# EAGLE design BEP33_2panel_v2_90Gradtvm802 (EAGLE 7.7.0)
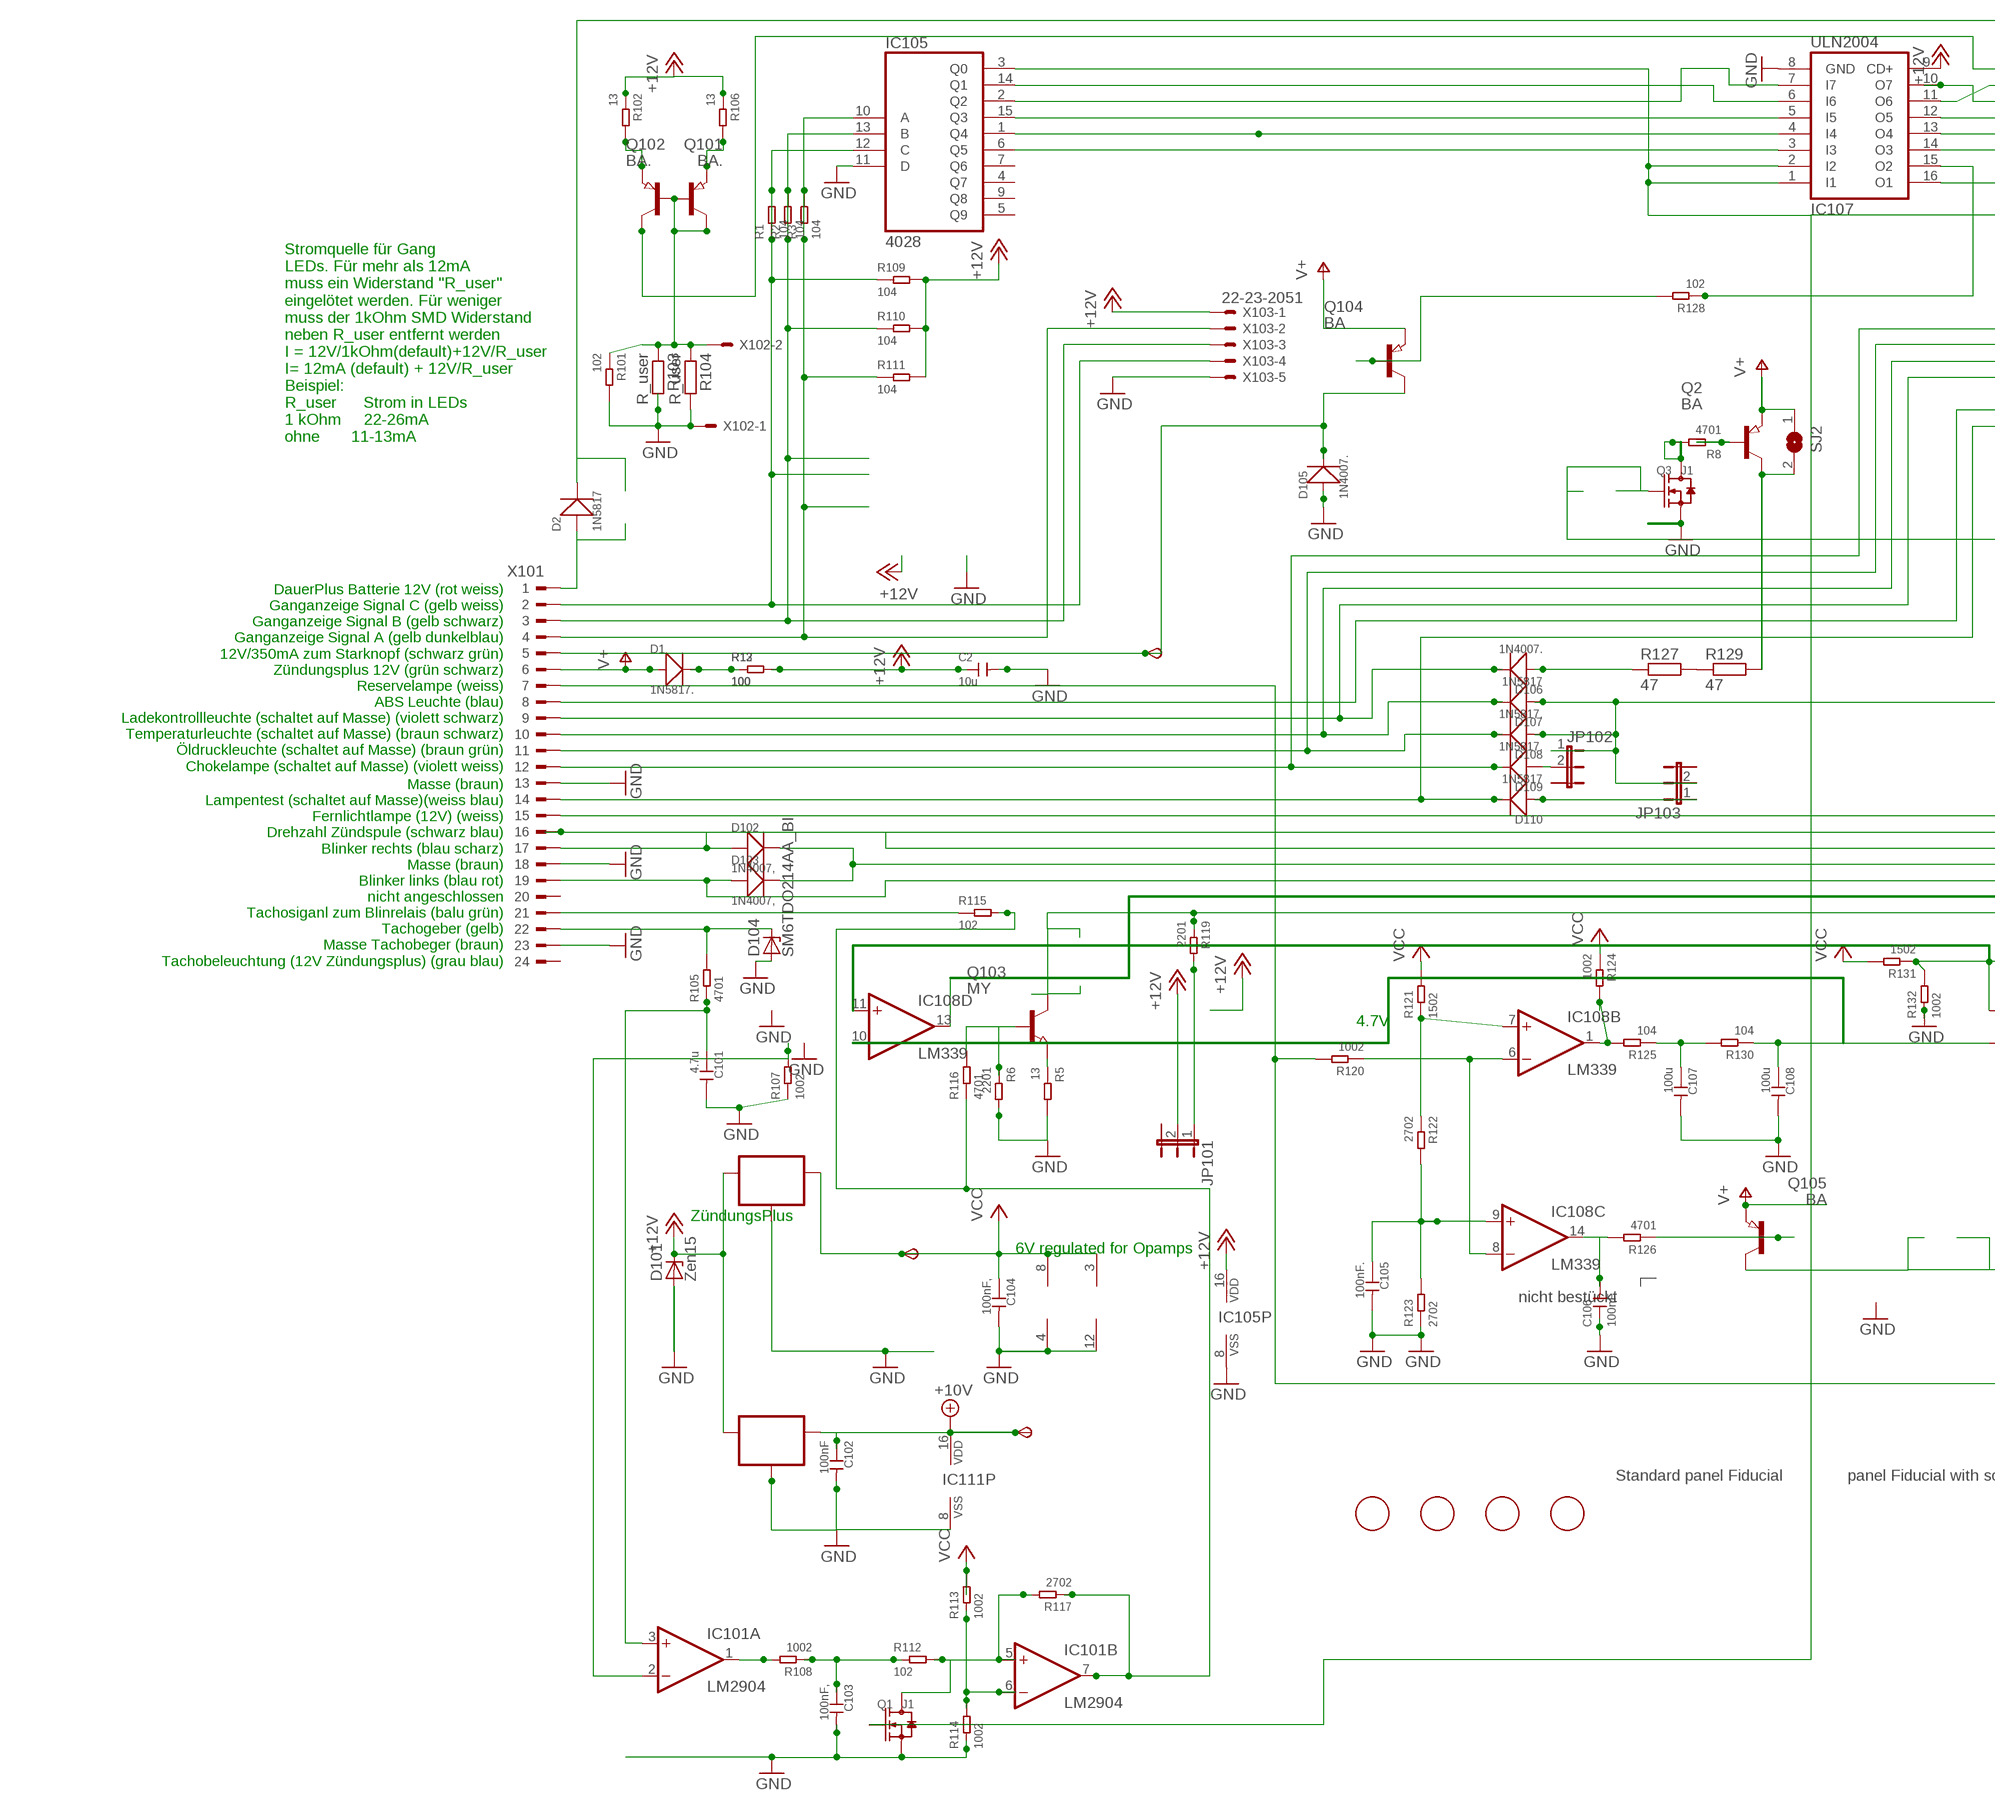
[diagram p0: schematic, sheet 1, part 1 of 2]
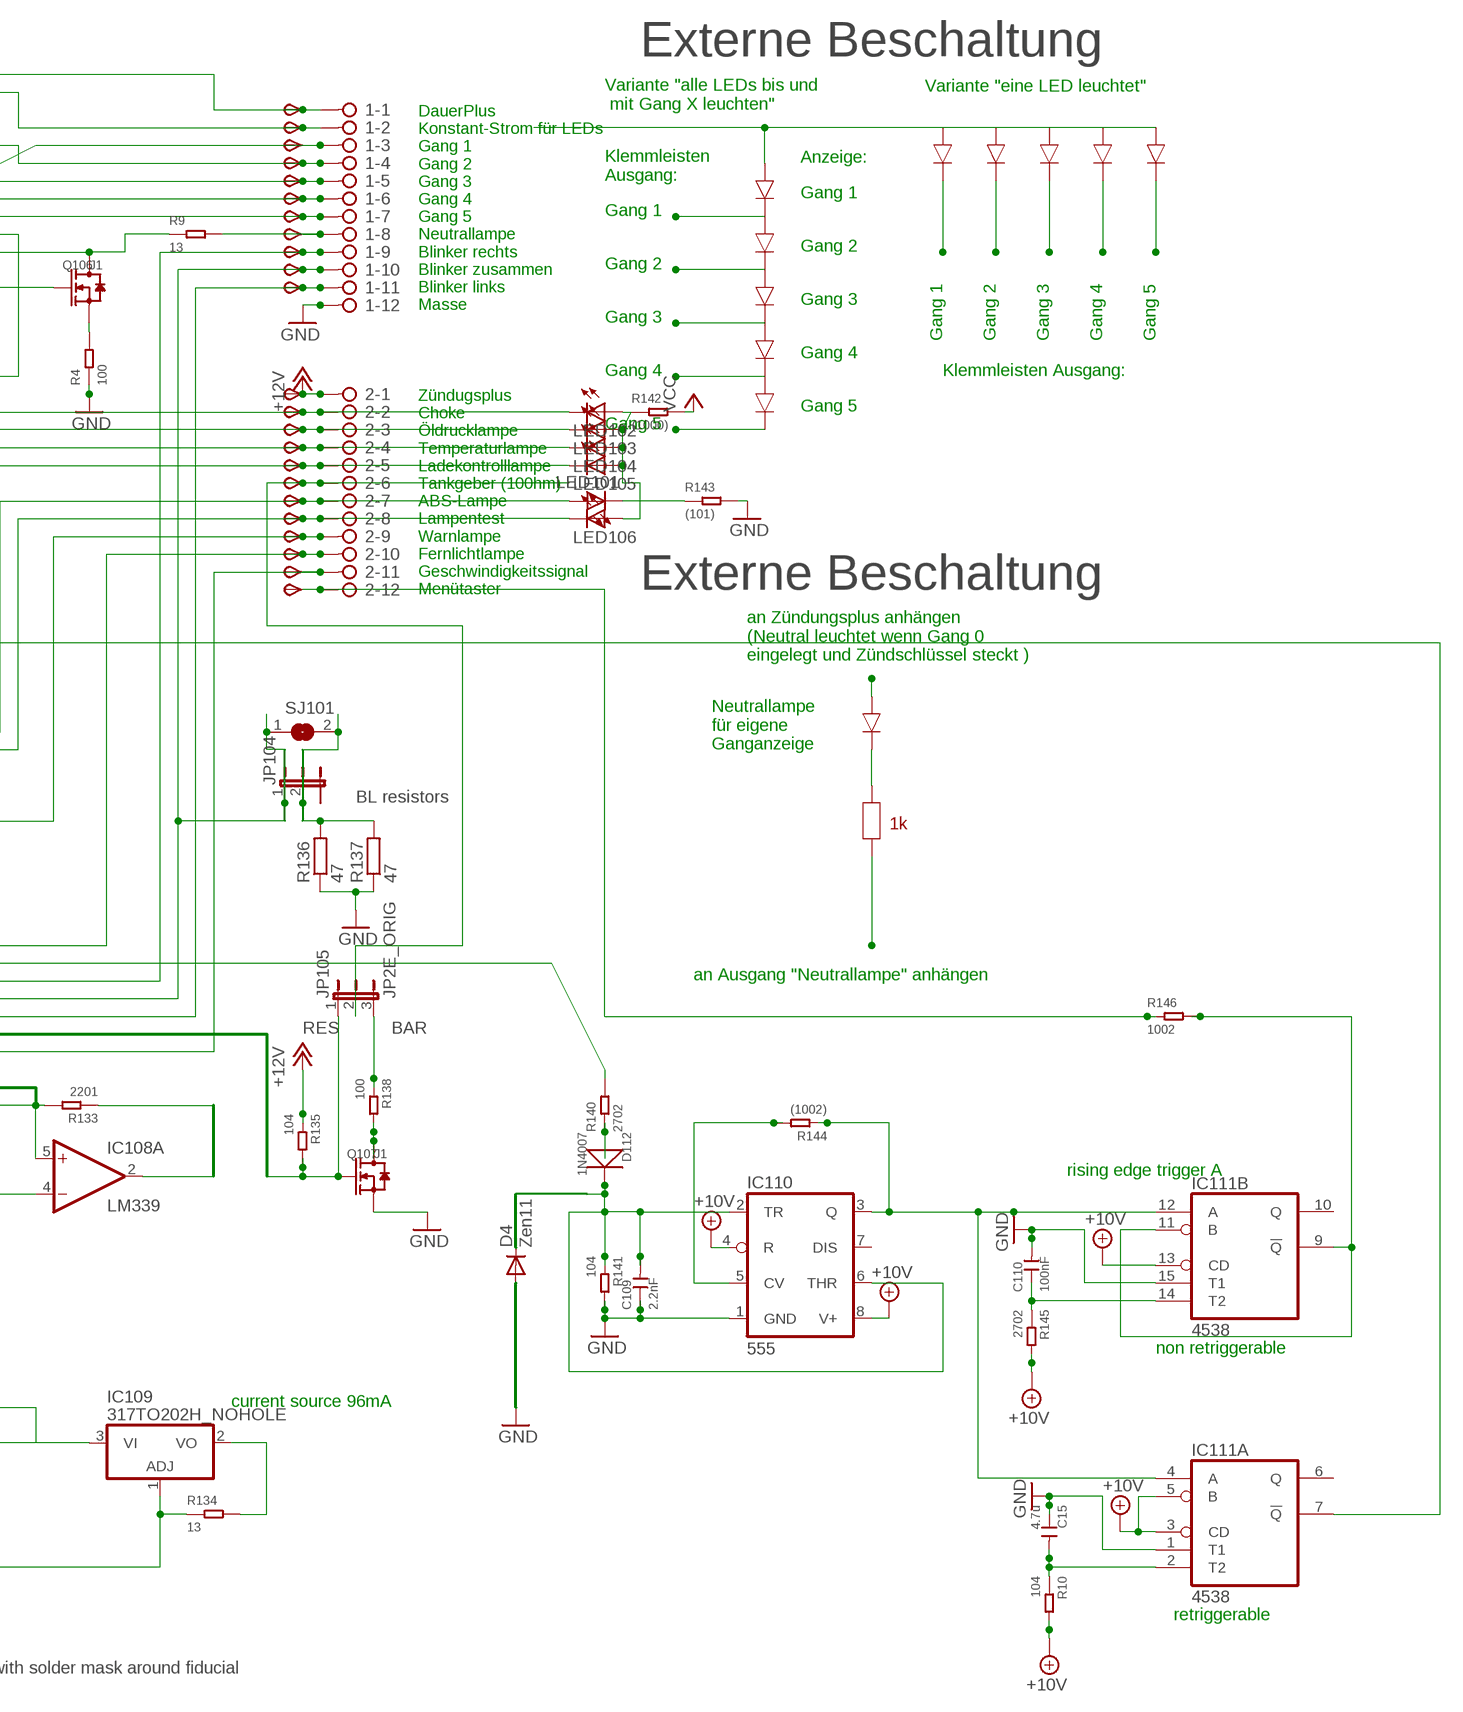
[diagram p1: schematic, sheet 1, part 2 of 2]

## Parts
1  2081-1132  [12-PIN]
2  2081-1132  [12-PIN]
6V  TPSB2.0  [B2.0]
10V  TPSB2.0  [B2.0]
C2  10u  CERAMIC-100UF-6.3V-20%-X5R(1206)  [C1206]
C15  4.7u  CERAMIC-4.7UF-25V-10%-X5R(0805)  [C0805]
C101  4.7u  CERAMIC-4.7UF-25V-10%-X5R(0805)  [C0805]
C102  100nF  CERAMIC-100NF-50V-10%-X7R(0805)  [C0805]
C103  100nF,  CERAMIC-100NF-50V-10%-X7R(0805)  [C0805]
C104  100nF,  CERAMIC-100NF-50V-10%-X7R(0805)  [C0805]
C105  100nF.  CERAMIC-100NF-50V-10%-X7R(0805)  [C0805]
C106  100nF.  CERAMIC-100NF-50V-10%-X7R(0805)  [C0805]
C107  100u  CERAMIC-100UF-6.3V-20%-X5R(1206)  [C1206]
C108  100u  CERAMIC-100UF-6.3V-20%-X5R(1206)  [C1206]
C109  2.2nF  CERAMIC-100NF-50V-10%-X7R(0805)  [C0805]
C110  100nF  CERAMIC-100NF-50V-10%-X7R(0805)  [C0805]
D1  1N5817.  DIODE-GEN-PURPOSE-1KV-1A(DO-214AC)DO-214AC/1206  [DO-214AC_SLIM]
D2  1N5817  DIODE-GEN-PURPOSE-1KV-1A(DO-214AC)DO-214AC/1206  [DO-214AC_SLIM]
D4  Zen11  CGRM4001-G  [SOD-123_MINI-SMA]
D101  Zen15  SM6T  [DO214AA]
D102  1N4007,  DIODE-GEN-PURPOSE-1KV-1A(DO-214AC)  [DO-214AC]
D103  1N4007,  DIODE-GEN-PURPOSE-1KV-1A(DO-214AC)  [DO-214AC]
D104  SM6TDO214AA_BI  [DO214AA_BI]
D105  1N4007.  DIODE-GEN-PURPOSE-1KV-1A(DO-214AC)  [DO-214AC]
D106  1N4007.  DIODE-GEN-PURPOSE-1KV-1A(DO-214AC)  [DO-214AC]
D107  1N5817  DIODE-GEN-PURPOSE-1KV-1A(DO-214AC)DO-214AC/1206  [DO-214AC_SLIM]
D108  1N5817.  DIODE-GEN-PURPOSE-1KV-1A(DO-214AC)DO-214AC/1206  [DO-214AC_SLIM]
D109  1N5817.  DIODE-GEN-PURPOSE-1KV-1A(DO-214AC)DO-214AC/1206  [DO-214AC_SLIM]
D110  1N5817  DIODE-GEN-PURPOSE-1KV-1A(DO-214AC)DO-214AC/1206  [DO-214AC_SLIM]
D112  1N4007  DIODE-GEN-PURPOSE-1KV-1A(DO-214AC)  [DO-214AC]
FID1  FIDUCIAL  [FIDUCIAL_1MM]
FID2  FIDUCIAL  [FIDUCIAL_1MM]
FID102  FIDUCIAL  [FIDUCIAL_1MM]
FID104  FIDUCIAL  [FIDUCIAL_1MM]
IC101  LM2904  LM358D  [SO08]
IC102  78L06  78LXXSOT89_ROUND  [SOT89_ROUND]
IC104  78L10  78LXXSOT89_ROUND  [SOT89_ROUND]
IC105  4028  4028D  [SO16]
IC107  ULN2004  ULN2004AD  [SO16]
IC108  LM339  LM339D  [SO14]
IC109  317TO202H_NOHOLE  [TO220H_NOHOLE]
IC110  555  NE555D  [SO08]
IC111  4538  4538D  [SO16]
JP101  JP2EJP2_SMALLPADS  [JP2_SMALLPADS]
JP102  JP2EJP2_SMALLPADS  [JP2_SMALLPADS]
JP103  JP2EJP2_SMALLPADS  [JP2_SMALLPADS]
JP104  JP2EJP2_SMALLPADS  [JP2_SMALLPADS]
JP105  JP2E_ORIG  [JP2_ORIG_SMALLPADS]
LED101  LEDLD260  [LD260]
LED102  LEDLD260  [LD260]
LED103  LEDLD260  [LD260]
LED104  LEDLD260  [LD260]
LED105  LEDLD260  [LD260]
LED106  LEDLD260  [LD260]
Q1  J1  SMD-MOSFET-N-CH-50V-200MA-BSS138W-7-F(SOT-23)  [SOT-23]
Q2  BA  PNP-TRANSISTOR_SOT89  [SOT89]
Q3  J1  SMD-MOSFET-N-CH-50V-200MA-BSS138W-7-F(SOT-23)  [SOT-23]
Q101  BA.  PNP-TRANSISTOR_SOT89  [SOT89]
Q102  BA.  PNP-TRANSISTOR_SOT89  [SOT89]
Q103  MY  NPN-TRANSISTOR_SOT89  [SOT89]
Q104  BA  PNP-TRANSISTOR_SOT89  [SOT89]
Q105  BA  PNP-TRANSISTOR_SOT89  [SOT89]
Q106  J1  SMD-MOSFET-N-CH-50V-200MA-BSS138W-7-F(SOT-23)  [SOT-23]
Q107  J1  SMD-MOSFET-N-CH-50V-200MA-BSS138W-7-F(SOT-23)  [SOT-23]
R1  104  SMD-RES-10K-1%-1/8W(0805)  [R0805]
R2  104  SMD-RES-10K-1%-1/8W(0805)  [R0805]
R3  104  SMD-RES-10K-1%-1/8W(0805)  [R0805]
R4  100  SMD-RES-220R-5%-1/8W(0805)  [R0805]
R5  13  SMD-RES-13R-5%-1/4W(1206)  [R1206]
R6  2201  SMD-RES-1K-5%-1/8W(0805)  [R0805]
R8  4701  SMD-RES-4.7K-5%-1/8W(0805)  [R0805]
R9  13  SMD-RES-13R-5%-1/4W(1206)  [R1206]
R10  104  SMD-RES-4.7K-5%-1/8W(0805)  [R0805]
R12  100  SMD-RES-2.2K-5%-1/8W(0805)  [R0805]
R13  100  SMD-RES-2.2K-5%-1/8W(0805)  [R0805]
R101  102  SMD-RES-1K-5%-1/8W(0805)  [R0805]
R102  13  SMD-RES-13R-5%-1/4W(1206)  [R1206]
R103  R_user  R-EU_R0805  [R0805]
R104  R_user  R-EU_R0805  [R0805]
R105  4701  SMD-RES-4.7K-5%-1/8W(0805)  [R0805]
R106  13  SMD-RES-13R-5%-1/4W(1206)  [R1206]
R107  1002  SMD-RES-10K-1%-1/8W(0805)  [R0805]
R108  1002  SMD-RES-10K-1%-1/8W(0805)  [R0805]
R109  104  SMD-RES-10K-1%-1/8W(0805)  [R0805]
R110  104  SMD-RES-10K-1%-1/8W(0805)  [R0805]
R111  104  SMD-RES-10K-1%-1/8W(0805)  [R0805]
R112  102  SMD-RES-1K-5%-1/8W(0805)  [R0805]
R113  1002  SMD-RES-1K-5%-1/8W(0805)  [R0805]
R114  1002  SMD-RES-1K-5%-1/8W(0805)  [R0805]
R115  102  SMD-RES-220R-5%-1/8W(0805)  [R0805]
R116  4701  SMD-RES-4.7K-5%-1/8W(0805)  [R0805]
R117  2702  SMD-RES-4.7K-5%-1/8W(0805)  [R0805]
R119  2201  SMD-RES-2.2K-5%-1/8W(0805)  [R0805]
R120  1002  SMD-RES-10K-1%-1/8W(0805)  [R0805]
R121  1502  SMD-RES-10K-1%-1/8W(0805)  [R0805]
R122  2702  SMD-RES-4.7K-5%-1/8W(0805)  [R0805]
R123  2702  SMD-RES-4.7K-5%-1/8W(0805)  [R0805]
R124  1002  SMD-RES-10K-1%-1/8W(0805)  [R0805]
R125  104  SMD-RES-10K-1%-1/8W(0805)  [R0805]
R126  4701  SMD-RES-4.7K-5%-1/8W(0805)  [R0805]
R127  47  R-EU_V235/17_1MM  [V235/17_1MM]
R128  102  SMD-RES-1K-5%-1/8W(0805)  [R0805]
R129  47  R-EU_V235/17_1MM  [V235/17_1MM]
R130  104  SMD-RES-10K-1%-1/8W(0805)  [R0805]
R131  1502  SMD-RES-10K-1%-1/8W(0805)  [R0805]
R132  1002  SMD-RES-10K-1%-1/8W(0805)  [R0805]
R133  2201  SMD-RES-2.2K-5%-1/8W(0805)  [R0805]
R134  13  SMD-RES-13R-5%-1/4W(1206)  [R1206]
R135  104  SMD-RES-10K-1%-1/8W(0805)  [R0805]
R136  47  R-EU_V235/17_1MM  [V235/17_1MM]
R137  47  R-EU_V235/17_1MM  [V235/17_1MM]
R138  100  SMD-RES-2.2K-5%-1/8W(0805)  [R0805]
R140  2702  SMD-RES-10K-1%-1/8W(0805)  [R0805]
R141  104  SMD-RES-10K-1%-1/8W(0805)  [R0805]
R142  (1000)  SMD-RES-100R-5%-1/8W(0805)  [R0805]
R143  (101)  SMD-RES-100R-5%-1/8W(0805)  [R0805]
R144  (1002)  SMD-RES-10K-1%-1/8W(0805)  [R0805]
R145  2702  SMD-RES-4.7K-5%-1/8W(0805)  [R0805]
R146  1002  SMD-RES-4.7K-5%-1/8W(0805)  [R0805]
SJ2  SJ  [SJ]
SJ101  SJ  [SJ]
START  TPSB2.0  [B2.0]
TP1  TPSB2.0  [B2.0]
TP2  TPSB2.0  [B2.0]
TP3  TPSB2.0  [B2.0]
TP4  TPSB2.0  [B2.0]
TP5  TPSB2.0  [B2.0]
TP6  TPSB2.0  [B2.0]
TP7  TPSB2.0  [B2.0]
TP8  TPSB2.0  [B2.0]
TP9  TPSB2.0  [B2.0]
TP10  TPSB2.0  [B2.0]
TP11  TPSB2.0  [B2.0]
TP12  TPSB2.0  [B2.0]
TP13  TPSB2.0  [B2.0]
TP16  TPSB2.0  [B2.0]
TP17  TPSB2.0  [B2.0]
TP18  TPSB2.0  [B2.0]
TP19  TPSB2.0  [B2.0]
TP21  TPSB2.0  [B2.0]
TP22  TPSB2.0  [B2.0]
TP23  TPSB2.0  [B2.0]
TP24  TPSB1,27  [B1,27]
TP25  TPSB2.0  [B2.0]
TP26  TPSB2.0  [B2.0]
X101  CON_BMWV2  [24-PIN_V2]
X102  22-23-2021  [22-23-2021]
X103  22-23-2051  [22-23-2051]

## Nets
+10V: 10V.TP(PP) C102.1 IC104.1(OUT) IC110.4(R) IC110.8(V+) IC111.3(A:CD) IC111.5(A:B) IC111.13(B:CD) IC111.16(P:VDD) R10.2 R145.2
+12V: 2.1 C2.1 D101.C IC102.3(IN) IC104.3(IN) IC105.16(VDD) IC107.9(CD+) JP101.2 R12.2 R13.2 R102.1 R106.1 R109.2 R110.2 R111.2 R135.1 TP12.TP(PP) X103.1
+12V1: 2.11 Q103.2(C) R119.1 TP26.TP(PP)
GND: 1.12 C2.2 C15.1 C101.2 C102.2 C103.2 C104.2 C105.2 C106.1 C107.2 C108.2 C109.1 C110.2 D4.A D101.A D104.A D105.1(+) IC101.4(P:V-) IC102.2(GND) IC102.2@1(GND) IC104.2(GND) IC104.2@1(GND) IC105.8(VSS) IC105.11(D) IC107.8(GND) IC108.12(P:GND) IC110.1(GND) IC111.1(A:T1) IC111.8(P:VSS) IC111.15(B:T1) Q1.2(S) Q3.2(S) Q107.2(S) R4.1 R5.2 R6.2 R101.2 R103.2 R104.2 R107.1 R114.1 R123.1 R132.1 R136.1 R137.1 R141.2 R143.2 X101.13 X101.18 X101.23 X102.1 X103.5
N$1: 2.9 D107.1(+) D108.1(+) JP102.1 JP103.2 TP24.TP(PP)
N$2: IC105.10(A) R3.1 R3.2 R111.1 X101.4 X103.2
N$3: IC105.13(B) R2.1 R2.2 R110.1 X101.3 X103.3
N$4: 2.7 LED101.A TP22.TP(PP) X101.8
N$5: Q101.3(E) R102.2
N$6: Q2.1(B) R8.1
N$7: IC101.2(A:-IN) R107.2
N$8: R127.2 R129.1
N$9: Q102.3(E) R106.2
N$11: D105.2(-) Q104.2(C) START.TP(PP) X101.5
N$12: 2.2 D109.2(-) LED102.K(C) TP16.TP(PP) X101.12
N$13: 2.3 D108.2(-) LED103.K(C) TP17.TP(PP) X101.11
N$14: 2.4 D107.2(-) LED104.K(C) TP18.TP(PP) X101.10
N$15: IC109.3(VI) Q105.2(C)
N$16: IC108.6(B:-IN) IC108.8(C:-IN) R120.1
N$17: IC105.12(C) R1.1 R1.2 R109.1 X101.2 X103.4
N$18: IC105.15(Q3) IC107.5(I5)
N$19: 2.8 D110.2(-) LED106.K(C) TP23.TP(PP) X101.14
N$20: 1.9 D102.1(+) TP9.TP(PP) X101.17
N$21: 1.11 D103.1(+) TP11.TP(PP) X101.19
N$22: IC111.9(B:!Q) IC111.11(B:B) R146.2
N$23: D104.C R105.2 X101.22
N$24: C101.1 IC101.3(A:+IN) R105.1
N$25: 1.6 IC107.13(O4) TP6.TP(PP)
N$26: 1.7 IC107.14(O3) TP7.TP(PP)
N$27: D1.2(-) R12.1 R13.1
N$28: 2.6 JP105.2 TP21.TP(PP)
N$29: JP101.1 R119.2
N$30: C105.1 IC108.9(C:+IN) R122.2 R123.2
N$31: C106.2 IC108.14(C:OUT) R126.2
N$32: Q3.3(D) R8.2
N$34: LED101.K(C) R143.1
N$35: IC109.1(ADJ) R120.2 R134.1 X101.7
N$36: Q105.1(B) R126.1
N$37: IC105.2(Q2) IC107.7(I7)
N$38: 1.3 IC107.11(O6) TP3.TP(PP)
N$39: 1.5 IC107.12(O5) TP5.TP(PP)
N$41: LED102.A LED103.A LED104.A LED105.A LED106.A R142.1
N$42: R140.2 X101.16
N$43: Q104.1(B) R128.2
N$44: IC105.3(Q0) IC107.1(I1) IC107.2(I2) Q1.1(G) Q106.1(G)
N$45: C107.1 R125.1 R130.2
N$46: C108.1 IC108.4(A:-IN) IC108.10(D:-IN) R130.1
N$47: IC108.5(A:+IN) IC108.11(D:+IN) R131.1 R132.2 R133.2
N$48: Q107.3(D) R138.2
N$49: IC111.7(A:!Q) Q3.1(G)
N$50: IC105.1(Q4) IC107.4(I4)
N$51: R115.1 X101.21
N$52: IC107.16(O1) Q106.3(D) R9.1
N$53: 2.10 TP25.TP(PP) X101.15
N$54: D106.1(+) R127.1
N$55: 2.5 D106.2(-) LED105.K(C) TP19.TP(PP) X101.9
N$56: IC105.14(Q1) IC107.6(I6)
N$57: Q101.1(B) Q102.1(B) Q102.2(C) R101.1 R103.1 R104.1 X102.2
N$58: 1.8 R9.2 TP8.TP(PP)
N$59: 1.2 Q101.2(C) TP2.TP(PP)
N$60: IC108.13(D:OUT) JP105.1 Q107.1(G) R135.2
N$61: IC105.6(Q5) IC107.3(I3)
N$64: IC109.2(VO) R134.2
N$65: IC110.5(CV) R144.2
N$67: 1.4 IC107.10(O7) TP4.TP(PP)
N$69: 1.1 D2.2(-) TP1.TP(PP)
N$83: IC108.7(B:+IN) R121.1 R122.1
N$84: Q106.2(S) R4.2
N$85: Q103.1(B) R6.1 R116.2
N$86: IC110.3(Q) IC111.4(A:A) IC111.12(B:A) R144.1
N$87: D112.1(+) R140.1
N$88: IC107.15(O2) R128.1
N$89: C110.1 IC111.14(B:T2) R145.1
N$90: 2.12 R146.1 TP13.TP(PP)
N$91: D2.1(+) X101.1
N$92: IC101.1(A:OUT) R108.2
N$93: 1.10 D102.2(-) D103.2(-) JP104.1 SJ101.1 TP10.TP(PP)
N$94: JP104.2 R136.2 R137.2 SJ101.2
N$95: D109.1(+) JP102.2
N$96: C103.1 R108.1 R112.1
N$97: IC101.5(B:+IN) Q1.3(D) R112.2 R117.2
N$98: D110.1(+) JP103.1
N$99: JP105.3 R138.1
N$100: Q103.3(E) R5.1
N$101: IC101.6(B:-IN) R113.1 R114.2
N$102: C109.2 D4.C D112.2(-) IC110.2(TR) IC110.6(THR) R141.1
N$103: C15.2 IC111.2(A:T2) R10.1
N$104: Q2.2(C) R129.2 SJ2.2
N$107: IC101.7(B:OUT) R115.2 R116.1 R117.1
N$108: IC108.2(A:OUT) R133.1
N$580: IC108.1(B:OUT) R124.2 R125.2
V+: D1.1(+) Q2.3(E) Q104.3(E) Q105.3(E) SJ2.1 X101.6
VCC: 6V.TP(PP) C104.1 IC101.8(P:V+) IC102.1(OUT) IC108.3(P:V+) R113.2 R121.2 R124.1 R131.2 R142.2
Unconnected: IC105.4(Q7) IC105.5(Q9) IC105.7(Q6) IC105.9(Q8) IC110.7(DIS) IC111.6(A:Q) IC111.10(B:Q) X101.20 X101.24

## Notes on the sheet
- Externe Beschaltung
- Variante "eine LED leuchtet"
- Variante "alle LEDs bis und
   mit Gang X leuchten"
- Anzeige:
- Klemmleisten
  Ausgang:
- Gang 1
- DauerPlus
  Konstant-Strom für LEDs
  Gang 1
  Gang 2
  Gang 3
  Gang 4
  Gang 5
  Neutrallampe
  Blinker rechts
  Blinker zusammen
  Blinker links
  Masse
- Gang 1
- Gang 2
- Gang 2
- Gang 3
- Gang 3
- Gang 1 | Gang 2 | Gang 3 | Gang 4 | Gang 5
- Gang 4
- Gang 4 | Klemmleisten Ausgang:
- Gang 5
- Gang 5
- Zündugsplus
  Choke
  Öldrucklampe
  Temperaturlampe
  Ladekontrolllampe
  Tankgeber (100hm)
  ABS-Lampe
  Lampentest
  Warnlampe
  Fernlichtlampe
  Geschwindigkeitssignal
  Menütaster
- Stromquelle für Gang
  LEDs. Für mehr als 12mA
  muss ein Widerstand "R_user"
  eingelötet werden. Für weniger
  muss der 1kOhm SMD Widerstand
  neben R_user entfernt werden
  I = 12V/1kOhm(default)+12V/R_user
  I= 12mA (default) + 12V/R_user
  Beispiel:
  R_user      Strom in LEDs
  1 kOhm     22-26mA
  ohne       11-13mA
- Externe Beschaltung
- an Zündungsplus anhängen
  (Neutral leuchtet wenn Gang 0
  eingelegt und Zündschlüssel steckt )
- Neutrallampe
  für eigene
  Ganganzeige
- DauerPlus Batterie 12V (rot weiss)
  Ganganzeige Signal C (gelb weiss)
  Ganganzeige Signal B (gelb schwarz)
  Ganganzeige Signal A (gelb dunkelblau)
  12V/350mA zum Starknopf (schwarz grün)
  Zündungsplus 12V (grün schwarz)
  Reservelampe (weiss)
  ABS Leuchte (blau)
  Ladekontrollleuchte (schaltet auf Masse) (violett schwarz)
  Temperaturleuchte (schaltet auf Masse) (braun schwarz)
  Öldruckleuchte (schaltet auf Masse) (braun grün)
  Chokelampe (schaltet auf Masse) (violett weiss)
- BL resistors
- 1k
- an Ausgang "Neutrallampe" anhängen
- Masse (braun)
  Lampentest (schaltet auf Masse)(weiss blau)
  Fernlichtlampe (12V) (weiss)
  Drehzahl Zündspule (schwarz blau)
  Blinker rechts (blau scharz)
  Masse (braun)
  Blinker links (blau rot)
  nicht angeschlossen
  Tachosiganl zum Blinrelais (balu grün)
  Tachogeber (gelb)
  Masse Tachobeger (braun)
  Tachobeleuchtung (12V Zündungsplus) (grau blau)
- RES | BAR
- 4.7V | rising edge trigger A
- non retriggerable
- ZündungsPlus
- current source 96mA
- 6V regulated for Opamps
- nicht bestückt
- retriggerable
- Standard panel Fiducial | panel Fiducial with solder mask around fiducial

## Library data of the parts
1 2 = con WAGO BMW:2081-1132: WAGO SREW CLAMP
6V 10V START TP1-TP13 TP16-TP19 TP21-TP26 = testpin_BMW:TPS: TEST PIN
C2 C107 C108 = Seeed-Capacitor-2016:CERAMIC-100UF-6.3V-20%-X5R(1206): 302010183; MPN: GRM31CR60J107ME39L; VALUE: 100uf
C15 C101 = Seeed-Capacitor-2016:CERAMIC-4.7UF-25V-10%-X5R(0805): 302010146; MPN: CC0805KKX5R8BB475; VALUE: 4.7uf
C102-C106 C109 C110 = Seeed-Capacitor-2016:CERAMIC-100NF-50V-10%-X7R(0805): 302010165; MPN: CC0805KRX7R9BB104; VALUE: 100nf
D1 D2 D107-D110 = Diode-do214ac:DIODE-GEN-PURPOSE-1KV-1A(DO-214AC): 304010013
D4 = diode:CGRM400*-G: Molded plasitc,JEDEC SOD-123/Mini SMA Source: Comchip CGRM4001-G.pdf
D101 D104 = Suppressor_Diode_DO214AA:SM6T: Z DIODE
D102 D103 D105 D106 = Diode-do214ac:DIODE-GEN-PURPOSE-1KV-1A(DO-214AC): 304010013; MPN: 1N4007; VALUE: 1N4007
D112 = Diode-do214ac:DIODE-GEN-PURPOSE-1KV-1A(DO-214AC): 304010013; MPN: 1N4007
FID1 FID2 FID102 FID104 = Fiducial:FIDUCIAL: For use by pick and place machines to calibrate the vision/machine, 1mm By microbuilder.eu
IC101 = linear_BMW:LM358: OP AMP also LM158; LM258; LM2904 Source: http://cache.national.com/ds/LM/LM158.pdf
IC102 IC104 = 78LXX:78LXX
IC105 = 4028:4028: BCD to decimal DECODER
IC107 = uln-udn:ULN2004A: DRIVER ARRAY
IC108 = LM339:LM339: Low Power Low Offset Voltage Quad Comparators with open collector; LM139/LM239/LM339/LM2901/LM3302
IC109 = linear_BMW:*317: Positive VOLTAGE REGULATOR
IC110 = linear:*555: TIMER
IC111 = 45xx:4538: Dual precision monostable MULTIVIBRATOR
JP101-JP104 = Switch Aliexpress 2:JP2E: JUMPER
JP105 = Switch Aliexpress 2:JP2E_ORIG
LED101-LED106 = led:LED: LED OSRAM: - CHIPLED LG R971, LG N971, LY N971, LG Q971, LY Q971, LO R971, LY R971 LH N974, LH R974 LS Q976, LO Q976, LY Q976 LO Q996 - Hyper CHIPLED LW Q18S LB Q993, LB Q99A, LB R99A - SideLED LS A670, LO A670, LY A670, LG A670, LP A670 LB A673, LV A673, LT A673, LW A673 LH A674 LY A675 LS A676, LA A676, LO A676, LY A676, LW A676 LS A679, LY A679, LG A679 - Hyper Micro SIDELED® LS Y876, LA Y876, LO Y876, LY Y876 LT Y87S - SmartLED LW L88C, LW L88S LB L89C, LB L89S, LG L890 LS L89K, LO L89K, LY L89K LS L896, LA L896, LO L896, LY L896 - TOPLED LS T670, LO T670, LY T670, LG T670, LP T670 LSG T670, LSP T670, LSY T670, LOP T670, LYG T670 LG T671, LOG T671, LSG T671 LB T673, LV T673, LT T673, LW T673 LH T674 LS T676, LA T676, LO T676, LY T676, LB T676, LH T676, LSB T676, LW T676 LB T67C, LV T67C, LT T67C, LS T67K, LO T67K, LY T67K, LW E67C LS E67B, LA E67B, LO E67B, LY E67B, LB E67C, LV E67C, LT E67C LW T67C LS T679, LY T679, LG T679 LS T770, LO T770, LY T770, LG T770, LP T770 LB T773, LV T773, LT T773, LW T773 LH T774 LS E675, LA E675, LY E675, LS T675 LS T776, LA T776, LO T776, LY T776, LB T776 LHGB T686 LT T68C, LB T68C - Hyper Mini TOPLED® LB M676 - Mini TOPLED Santana® LG M470 LS M47K, LO M47K, LY M47K Source: http://www.osram.convergy.de LUXEON: - LUMILED® LXK2-PW12-R00, LXK2-PW12-S00, LXK2-PW14-U00, LXK2-PW14-V00 LXK2-PM12-R00, LXK2-PM12-S00, LXK2-PM14-U00 LXK2-PE12-Q00, LXK2-PE12-R00, LXK2-PE12-S00, LXK2-PE14-T00, LXK2-PE14-U00 LXK2-PB12-K00, LXK2-PB12-L00, LXK2-PB12-M00, LXK2-PB14-N00, LXK2-PB14-P00, LXK2-PB14-Q00 LXK2-PR12-L00, LXK2-PR12-M00, LXK2-PR14-Q00, LXK2-PR14-R00 LXK2-PD12-Q00, LXK2-PD12-R00, LXK2-PD12-S00 LXK2-PH12-R00, LXK2-PH12-S00 LXK2-PL12-P00, LXK2-PL12-Q00, LXK2-PL12-R00 Source: www.luxeon.com KINGBRIGHT: KA-3528ASYC Source: www.kingbright.com
Q1 Q3 Q106 Q107 = Seeed-Transistor-2016:SMD-MOSFET-N-CH-50V-200MA-BSS138W-7-F(SOT-23): 305030000; MPN: BSS138W-7-F; VALUE: BSS138W-7-F
Q2 Q101 Q102 Q104 Q105 = Transistor_SOT89:PNP-TRANSISTOR_: PNP TRANSISTOR
Q103 = Transistor_SOT89:NPN-TRANSISTOR_: NPN TRANSISTOR
R1-R3 R107-R111 R120 R121 R124 R125 R130-R132 R135 R140 R141 R144 = Seeed-Resistor-2016:SMD-RES-10K-1%-1/8W(0805): 301010361; MPN: RC0805FR-0710KL; VALUE: 10K
R4 R115 = Seeed-Resistor-2016:SMD-RES-220R-5%-1/8W(0805): 301010315; MPN: RC0805JR-07220RL; VALUE: 220R
R5 R9 R102 R106 R134 = Seeed-Resistor-2016:SMD-RES-13R-5%-1/4W(1206): 301010405; MPN: RC1206JR-0713RL; VALUE: 13R
R6 R101 R112-R114 R128 = Seeed-Resistor-2016:SMD-RES-1K-5%-1/8W(0805): 301010311; MPN: RC0805JR-071KL; VALUE: 1K
R8 R10 R105 R116 R117 R122 R123 R126 R145 R146 = Seeed-Resistor-2016:SMD-RES-4.7K-5%-1/8W(0805): 301010306; MPN: RC0805JR-074K7L; VALUE: 4.7K
R12 R13 R119 R133 R138 = Seeed-Resistor-2016:SMD-RES-2.2K-5%-1/8W(0805): 301010333; MPN: RC0805JR-072K2L; VALUE: 2.2K
R103 R104 R127 R129 R136 R137 = rcl:R-EU_: RESISTOR, European symbol
R142 R143 = Seeed-Resistor-2016:SMD-RES-100R-5%-1/8W(0805): 301010319; MPN: RC0805JR-07100RL; VALUE: 100R
SJ2 = jumper:SJ: SMD solder JUMPER
SJ101 = solder-jumper:SJ: SMD solder JUMPER
X101 = con_BMW:CON_BMW: BMW CONNECTOR
X102 = con_Molex_BMW:22-23-2021: .100" (2.54mm) Center Header - 2 Pin; MF: MOLEX; MPN: 22-23-2021; OC_FARNELL: 1462926; OC_NEWARK: 25C3832
X103 = con_Molex_BMW:22-23-2051: .100" (2.54mm) Center Header - 5 Pin; MF: MOLEX; MPN: 22-23-2051; OC_FARNELL: 1462952; OC_NEWARK: 38C9178

## Board
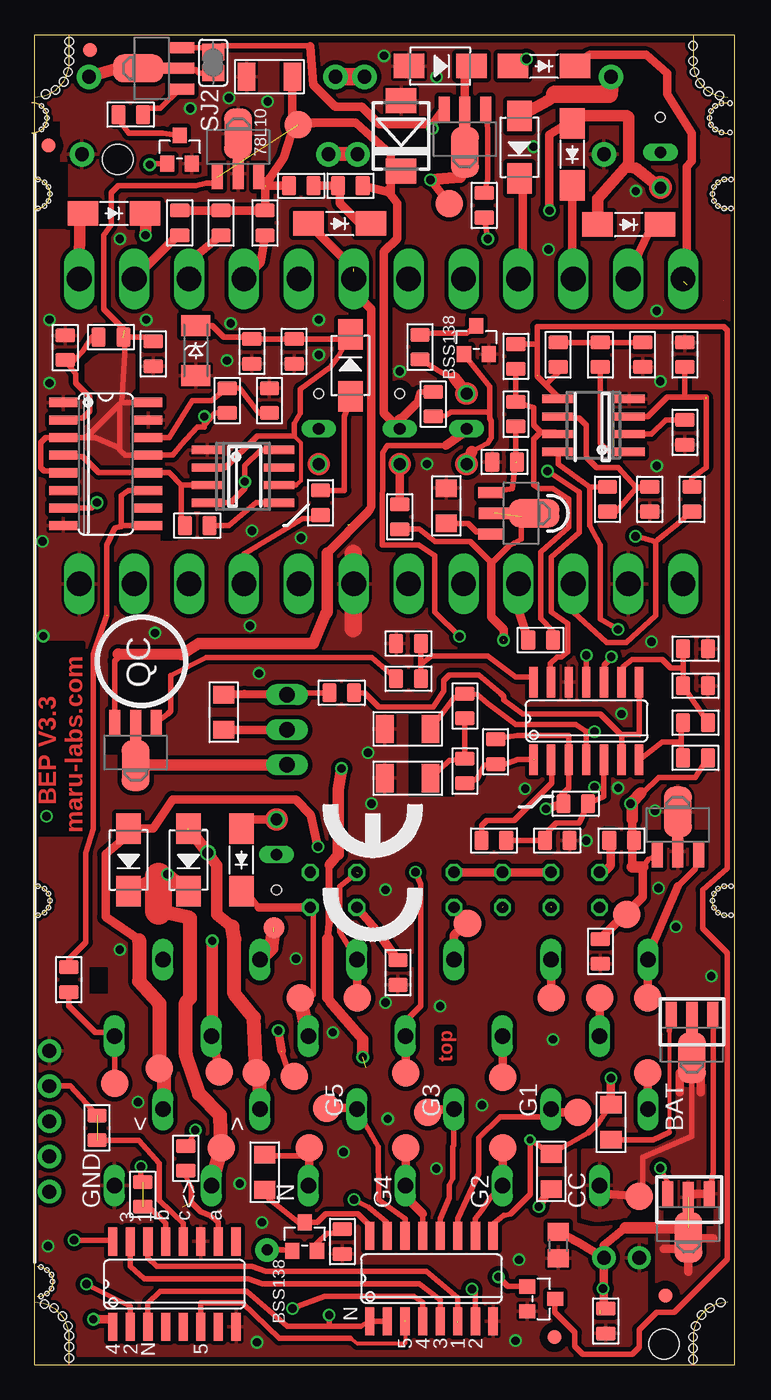
[diagram p2: board, top side]
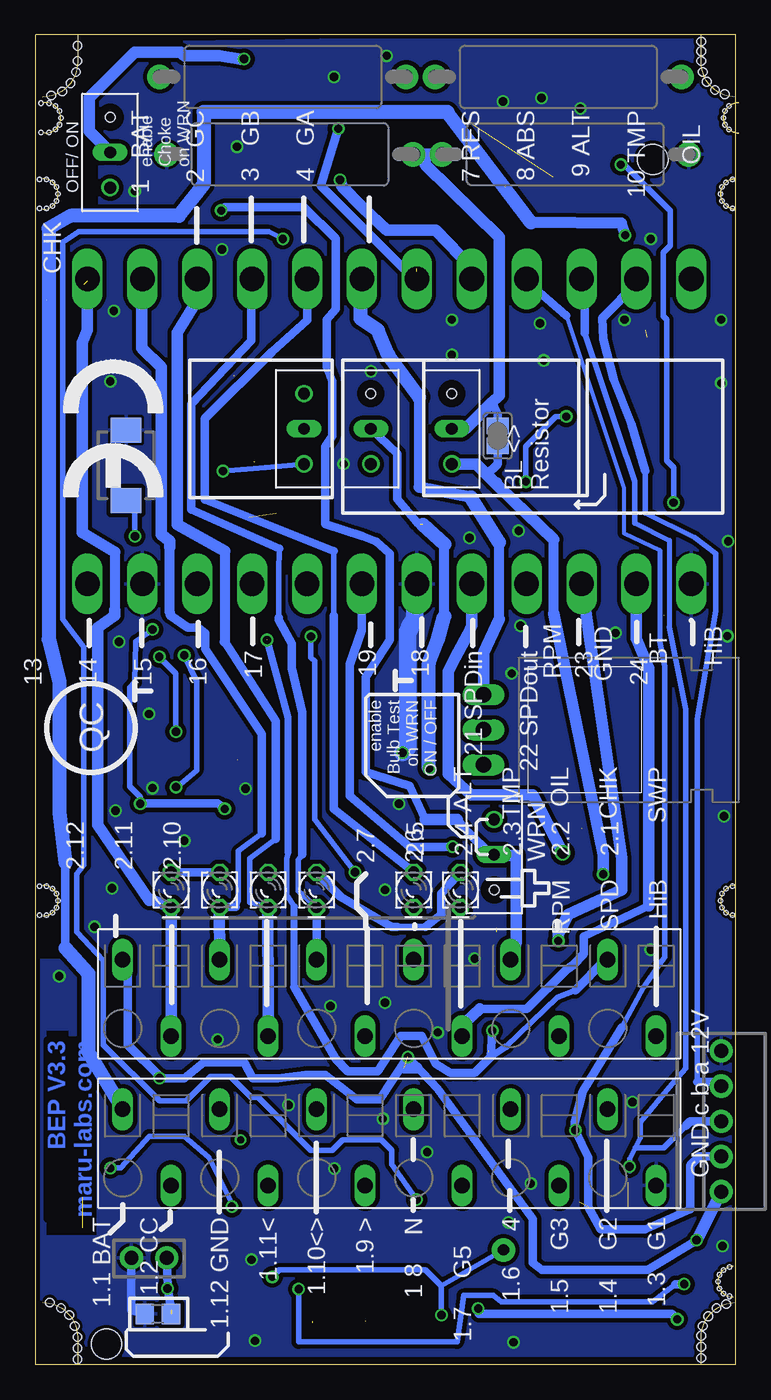
[diagram p3: board, bottom side, seen from below]

Size 50.5 x 96 mm. Coordinates in mm from the lower left corner, seen from the top.
Outline: 50.5,0 50.5,96 0,96 0,0 50.5,0
Copper layers (1*16): Top 0.035mm / dielectric 1.5mm / Bottom 0.035mm
Design rules "Vorlage BEP3 und hoeher multi-cb_035um-cu": minimum track width 6mil, minimum drill 12mil, track to track 12mil, track to pad 12mil, pad to pad 6mil, via to via 6mil, smd to smd 6mil, copper to edge 10mil, drill to drill 8mil, minimum pad ring 8mil, minimum via ring 6mil, stop-mask expansion 3mil, vias tented up to drill 0mil, thermal gap 8mil
Holes 2.18 mm at 45.4,1.5 6,87
Holes 0.6 mm at 0.7,4.4 1.4,4.1 2,3.5 2.4,2.8 2.5,2.1 2.5,1.3 2.5,0.5 47.5,0.4 47.5,1.2 47.5,2 47.7,2.8 48.1,3.6 48.7,4.1 49.5,4.5 49.4,91.6 48.6,91.9 48,92.5 47.6,93.3 47.5,94.1 47.5,95.2 2.5,95.5 2.5,94.8 2.5,94.1 2.4,93.3 2.1,92.6 1.5,92 0.8,91.7
Holes 0.3 mm at 49.75,83.45 49.3,83.65 49,84 48.9,84.5 49,85 49.3,85.35 49.75,85.55 49.75,32.45 49.3,32.65 49,33 48.9,33.5 49,34 49.3,34.35 49.75,34.55 49.55,88.95 49.1,89.15 48.8,89.5 48.7,90 48.8,90.5 49.1,90.85 49.55,91.05 50.25,34.55 50.25,32.45 50.25,85.55 50.25,83.45 50.15,88.95 50.15,91.05 0.25,34.55 0.7,34.35 1,34 1.1,33.5 1,33 0.7,32.65 0.25,32.45 0.25,85.55 0.7,85.35 1,85 1.1,84.5 1,84 0.7,83.65 0.25,83.45 0.5,90.85 0.8,90.5 0.9,90 0.8,89.5 0.5,89.15 0.45,7.05 0.9,6.85 1.2,6.5 1.3,6 1.2,5.5 0.9,5.15 0.45,4.95
tRestrict: area 27,41 to 30.3,47.5; area 4,26.8 to 5.3,28.7; area 32.7,58.4 to 34.7,60.2; area 5.1,44.1 to 9.4,45.5; area 44.1,37.3 to 48.6,38.6; area 45.4,10 to 48.9,11.4; area 27.7,88.4 to 28.9,90; area -0.9,86.4 to 1.8,89.7; area -0.6,82 to 2.4,86.8; area 9.1,59.5 to 10.3,63.7; area 15.6,13.4 to 17.3,14.5; area 0,7.3 to 0,82; 1 more areas
bRestrict: area 46.1,9.4 to 49.7,19.6; area 48.2,19.5 to 49.7,24.1; area 48.2,29.3 to 50.4,35.8; area 46,81.6 to 49.8,87.6; area 0,7.3 to 0,82.3
Milling: 30 lines

### Footprints (pad centres in the part's own frame; a part is rotated, then mirrored left to right if it is on the bottom)
12-PIN = drill 1.118 long: 1 19.25,-2.45; 2 15.75,3.05; 3 12.25,-2.45; 4 8.75,3.05; 5 5.25,-2.45; 6 1.75,3.05; 7 -1.75,-2.45; 8 -5.25,3.05; 9 -8.75,-2.45; 10 -12.25,3.05; 11 -15.75,-2.45; 12 -19.25,3.05
B2.0 = smd 2 x 2: TP 0,0
C1206 = smd 1.27 x 2.032: 1 -1.651,0; 2 1.651,0
C0805 = smd 1.397 x 1.016: 1 0,0.889; 2 0,-0.889
DO-214AC_SLIM = smd 2.2 x 1.77: 1 -2.242,0; 2 2.242,0
SOD-123_MINI-SMA = smd 1.5 x 2.1: A 1.8,0; C -1.8,0
DO214AA = smd 1.8 x 2.2: A 2.55,0; C -2.55,0
DO-214AC = smd 2.2 x 1.77: 1 -2.242,0; 2 2.242,0
DO214AA_BI = smd 1.8 x 2.2: A 2.45,0; C -2.65,0
FIDUCIAL_1MM = smd 1 x 1: 1 0,0
SO08 = smd 0.6 x 2.2: 1 -1.905,-2.6; 2 -0.635,-2.6; 3 0.635,-2.6; 4 1.905,-2.6; 5 1.905,2.6; 6 0.635,2.6; 7 -0.635,2.6; 8 -1.905,2.6
SOT89_ROUND = smd 0.8 x 1.8: 1 -1.499,-2.181; 3 1.499,-2.181 | smd 0.8 x 2.3: 2 0,-1.927 | smd 2.032 x 3.65: 2@1 0,0.94
SO16 = smd 0.66 x 2.032: 1 -4.445,-3.073; 2 -3.175,-3.073; 3 -1.905,-3.073; 4 -0.635,-3.073; 5 0.635,-3.073; 6 1.905,-3.073; 7 3.175,-3.073; 8 4.445,-3.073; 9 4.445,3.073; 10 3.175,3.073; 11 1.905,3.073; 12 0.635,3.073; 13 -0.635,3.073; 14 -1.905,3.073; 15 -3.175,3.073; 16 -4.445,3.073
SO14 = smd 0.6 x 2.2: 1 -3.81,-2.8; 2 -2.54,-2.8; 3 -1.27,-2.8; 4 0,-2.8; 5 1.27,-2.8; 6 2.54,-2.8; 7 3.81,-2.8; 8 3.81,2.8; 9 2.54,2.8; 10 1.27,2.8; 11 0,2.8; 12 -1.27,2.8; 13 -2.54,2.8; 14 -3.81,2.8
TO220H_NOHOLE = drill 1.118 long: 1 -2.54,-10.16; 2 0,-10.16; 3 2.54,-10.16
JP2_SMALLPADS = drill 0.85: 1 -2.54,0 | drill 0.85 long: 2 0,0 | hole 0.7: 2.54,0
JP2_ORIG_SMALLPADS = drill 0.85: 1 -2.54,0; 3 2.54,0 | drill 0.85 long: 2 0,0
LD260 = drill 0.813 octagon: A -1.27,0; K 1.27,0
SOT-23 = smd 1.016 x 1.143: 1 -0.889,-1.016; 2 0.889,-1.016; 3 0,1.016
SOT89 = smd 0.8 x 1.8: 1 -1.499,-2.181; 3 1.499,-2.181 | smd 0.8 x 2.3: 2 0,-1.927 | smd 2.032 x 3.65: 2@1 0,0.94
R0805 = smd 1.397 x 1.016: 1 0,0.889; 2 0,-0.889
R1206 = smd 1.27 x 1.524: 1 -1.27,0; 2 1.27,0
R0805' = smd 1.3 x 1.5: 1 -0.95,0; 2 0.95,0
V235/17_1MM = drill 1 pad 1.778: 1 -8.89,0; 2 8.89,0
SJ = smd 1.168 x 1.6: 1 -0.762,0; 2 0.762,0
SJ' = smd 1.2 x 1.6: 1 -0.725,0; 2 0.725,0
B1,27 = smd 1.5 x 1.5: TP 0,0
24-PIN_V2 = drill 1.778 long: 1 -21.78,-11; 2 -17.82,-11; 3 -13.86,-11; 4 -9.9,-11; 5 -5.94,-11; 6 -1.98,-11; 7 1.98,-11; 8 5.94,-11; 9 9.9,-11; 10 13.86,-11; 11 17.82,-11; 12 21.78,-11; 13 -21.78,11; 14 -17.82,11; 15 -13.86,11; 16 -9.9,11; 17 -5.94,11; 18 -1.98,11; 19 1.98,11; 20 5.94,11; 21 9.9,11; 22 13.86,11; 23 17.82,11; 24 21.78,11
22-23-2021 = drill 1 pad 1.676: 1 -1.27,0; 2 1.27,0
22-23-2051 = drill 1 pad 1.676: 1 -5.08,0; 2 -2.54,0; 3 0,0; 4 2.54,0; 5 5.08,0

### Placement (x,y rotation side)
1  25,15.99 180 bottom
2  25,26.79 180 bottom
6V  42.72,32.5 90 top
10V  19,89.5 90 top
C2  16.94,92.96 180 top
C15  2.21,73.41 0 top
C101  46.91,72.9 180 top
C102  8.55,72.96 0 top
C103  43.86,72.9 0 top
C104  40.82,29.83 0 top
C105  47.67,49.01 90 top
C106  26.97,52.06 90 top
C107  26.91,42.34 180 top
C108  26.91,45.9 180 top
C109  18.72,73.14 180 top
C110  16.94,69.58 180 top
D1  22.01,82.36 0 top
D2  5.72,83.1 0 top
D4  11.62,73.2 270 top
D101  26.43,88.69 90 top
D102  11.1,36.44 270 top
D103  6.78,36.44 270 top
D104  43.99,65.01 90 bottom
D105  29.26,93.73 0 top
D106  34.97,87.87 270 top
D107  38.78,87.36 270 top
D108  42.86,82.3 0 top
D109  36.75,93.73 0 top
D110  14.91,36.44 270 top
D112  22.78,72.12 90 top
FID1  1,88 90 top
FID2  45.5,5 90 top
FID102  37.5,2 90 top
FID104  4,94.9 90 top
IC101  40.31,67.81 90 top
IC102  46.4,38.98 0 top
IC104  14.68,87.91 0 top
IC105  10.08,5.83 0 top
IC107  28.62,6.23 0 top
IC108  39.8,46.47 0 top
IC109  8.05,45.84 270 bottom
IC110  15.03,64.12 270 top
IC111  5.13,65.01 270 top
JP101  26.34,67.55 90 bottom
JP102  45.15,87.5 90 bottom
JP103  17.45,36.82 270 bottom
JP104  20.5,67.55 90 bottom
JP105  31.16,67.55 90 bottom
LED101  23.25,34.28 270 bottom
LED102  40.75,34.28 270 bottom
LED103  37.25,34.28 270 bottom
LED104  33.75,34.28 270 bottom
LED105  30.25,34.28 270 bottom
LED106  19.88,34.28 270 bottom
Q1  36.54,4.77 270 top
Q2  8.42,93.57 90 top
Q3  10.45,87.7 0 top
Q101  47.42,23.1 180 top
Q102  47.17,10.15 180 top
Q103  35.1,61.46 270 top
Q104  31.04,88.44 180 top
Q105  7.29,44.18 180 top
Q106  19.48,9.26 0 top
Q107  31.86,73.97 0 top
R1  4.5,17.1 180 top
R2  7.8,12.3 180 top
R3  10.9,14.9 180 top
R4  22.2,8.9 180 top
R5  29.7,62 90 top
R6  33.9,65.16 270 top
R8  6.92,90.23 270 top
R9  16.6,13.9 90 top
R10  5.51,74.17 90 top
R12  22.78,85.09 90 top
R13  19.23,85.09 270 top
R101  41.2,3.16 0 top
R102  41.58,17.51 270 top
R103  R_user  [R0805']  37.77,8.64 270 top
R104  R_user  [R0805']  41.7,3.67 180 bottom
R105  47.42,62.47 0 top
R106  37.26,13.96 270 top
R107  46.91,67.3 180 top
R108  40.82,72.9 0 top
R109  10.46,82.41 180 top
R110  13.45,82.41 180 top
R111  16.62,82.41 180 top
R112  37.77,72.9 0 top
R113  41.32,62.47 180 top
R114  44.37,62.47 180 top
R115  36.5,52.31 90 top
R116  34.72,68.61 0 top
R117  34.72,72.78 180 top
R119  26.34,61.2 180 top
R120  22.15,48.5 270 top
R121  47.67,43.8 90 top
R122  47.67,46.34 90 top
R123  47.67,51.68 270 top
R124  33.26,44.25 0 top
R125  31.04,42.85 0 top
R126  26.97,49.52 90 top
R127  32.69,92.95 0 bottom
R128  32.43,83.68 180 top
R129  12.81,92.95 0 bottom
R130  31.04,47.55 0 top
R131  39.04,40.5 270 top
R132  37.7,37.83 270 top
R133  33.13,37.83 90 top
R134  13.64,47.1 270 top
R135  28.75,69.33 0 top
R136  32.18,87.36 0 bottom
R137  12.3,87.36 180 bottom
R138  27.8,73.46 180 top
R140  20.62,62.22 0 top
R141  15.67,73.14 0 top
R142  42.34,37.83 90 top
R143  26.21,28.31 0 top
R144  11.73,60.57 90 top
R145  13.89,69.58 0 top
R146  2.46,27.8 180 top
SJ2  12.88,93.98 270 top
SJ101  [SJ']  17.19,67.04 90 bottom
START  29.89,83.81 90 top
TP1  44.24,21.07 90 top
TP2  43.61,12.18 90 top
TP3  39.16,18.21 90 top
TP4  33.77,15.67 90 top
TP5  28.37,18.21 90 top
TP6  26.78,15.67 90 top
TP7  21.07,18.53 90 top
TP8  19.8,15.67 90 top
TP9  15.99,21.07 90 top
TP10  13.45,15.67 90 top
TP11  9,21.39 90 top
TP12  44.24,26.47 90 top
TP13  5.76,20.31 90 top
TP16  40.75,26.47 90 top
TP17  37.26,26.47 90 top
TP18  33.77,20.75 90 top
TP19  31.23,31.86 90 top
TP21  26.78,21.07 90 top
TP22  23.29,26.47 90 top
TP23  19.16,26.47 90 top
TP24  17.26,31.55 90 top
TP25  13.32,21.13 90 top
TP26  18.72,20.82 90 top
U$1  [CE_10.00]  48.56,72.63 270 bottom
U$2  [CE_10.00]  28.03,30.47 90 top
X101  25,67.36 180 bottom
X102  42.34,7.74 0 bottom
X103  1.06,17.58 90 bottom

### Tracks (layer width: path | path; a pad name or v marks a point on that pad's centre or on a via)
+10V  (via drill 0.6)  (2 unrouted)
  Top 0.406: 6.15,69.33 3.73,66.92 IC111.3 0.8,66.92 0.43,66.55 0.43,64.77 0.68,64.52 1.92,64.52 IC111.5 | 6.27,69.46 IC111.16 | 12.11,67.68 13,68.69 R145.2 | 6.15,66.16 6.15,66.03 6.53,65.65 IC111.13 9.95,65.65 10.59,66.41 11.73,67.68 12.11,67.68 | 6.15,66.16 6.15,69.33 | 6.15,69.33 6.27,69.46 | IC110.4 14.15,62.22 15.16,63.23 v15.16,63.74 15.16,64.89 16.3,66.03 IC110.8 | 6.27,69.46 6.51,73 6.51,74.69 5,76.2 5,81.53 5.51,82.3 5.51,84.59 6.02,85.1 11.61,85.1 12.37,85.27 12.92,85.27 IC104.1 | v12.24,68.44 12.24,67.68 12.11,67.68 | 6.15,66.16 4.37,66.92 3.99,66.92 3.99,67.04 | R10.2 8.24,74.17 C102.1
  Bottom 0.406: v12.24,68.44 13,68.44 15.16,66.28 v15.16,63.74
  pour Top: 3.73,64.38 3.73,72.14 3.99,72.38 4.24,72.63 4.75,72.9 7.16,72.89 7.16,70.47 6.78,70.09 6.78,64.5 3.86,64.5
+12V  (via drill 0.5, 0.6)  (3 unrouted)
  Top 0.35: 33.83,10.8 34.34,10.91
  Top 0.406: IC105.16 5.64,9.01 v2.84,9.01 | R102.1 40.69,17.51 39.93,16.75 R106.1 v35.74,16.24 35.74,12.31 34.34,10.91 | IC102.3 47.65,35.78 46.4,34.53 | R135.1 27.73,70.22 27.48,69.33 | IC107.9 33.07,10.17 33.83,10.8
  Top 0.5: 21.13,30.72 21.26,31.86 21.26,36.06
  Top 0.61: 43.86,26.09 TP12.TP 2.1 44.25,29.58 46.4,34.53 | 21.26,26.28 21.13,26.53 | R102.1 v41.58,20.69 | 27.48,69.33 26.34,68.19 | R109.2 R110.2 R111.2 16.62,85.09 | 16.69,85 16.86,85.51 | 21,89.66 20.43,89.66 18.79,89.73 17.96,87.12 17.01,85.67 16.62,85.16 | 21,89.66 23.16,89.66 25.7,87.38 25.7,86.11 | 25.7,86.11 25.7,84.58 | 25.7,84.58 25.45,84.77 26.15,83.82 26.15,81.28 25.2,80.33 25.2,68.69 JP101.2 | C2.1 18.59,89.53 21,89.66 | R12.2 25.7,84.58 | D101.C 26.25,86.14 25.7,86.11 | 16.62,85.09 16.62,85.16 | 16.62,85.16 IC104.3 | R13.2 16.62,85.09
  Top 0.711: 21.26,26.28 23.67,23.48 | 21.26,36.06 21.89,36.82
  Top 0.813: 23.67,23.48 v23.67,22.21 | 21.13,26.53 21.13,30.72 | 21.89,36.82 21.89,41.52 v22.15,43.04 | 26.34,68.19 JP101.2
  Bottom 0.61: v2.84,9.01 6.37,6.85 14.02,6.85 14.65,7.35 14.65,10.53 17.45,14.34 21.51,19.93 v23.67,22.21 25.7,19.16 27.35,19.16 29.64,20.94 31.04,20.94 33.07,20.69 34.85,20.69 35.48,21.83 38.4,21.83 39.8,20.69 v41.58,20.69 41.58,20.82 43.86,23.1 43.86,28.85 2.1 | JP101.2 24.43,65.77 24.43,62.47 23.04,60.82 22.78,60.63
  Bottom 0.711: 21.03,54.03 21.03,59.23
  Bottom 0.813: v2.84,9.01 X103.1 | 23.04,21.45 23.93,21.45
  Bottom 1.016: v22.15,43.04 22.15,50.66 21.51,52.31 21.03,54.03 | 21.03,59.23 22.59,60.63
+12V1  (via drill 0.6)  (3 unrouted)
  Top 0.406: TP26.TP 18.34,21.07 17.83,22.59 | R119.1 27.74,60.31 28.89,59.42 31.42,59.42 32.94,57.9 33,57.9 34.2,59.1 34.6,59.3 35.1,59.6 35.1,61.2 35.36,61.46 | Q103.2
  Top 0.61: 17.83,22.66 v17.58,24.12 | v33.83,52.31 33.83,53.09 32.94,53.98 32.94,57.9
  Bottom 0.406: 16.56,22.98 15.67,23.86 12.88,26.53 11.61,27.04 | 31.86,33.07 32.41,33.9 32.41,36.56 32.31,36.95
  Bottom 0.508: 16.56,22.98 17.7,22.21 | 31.86,27.29 31.86,33.07 | 32.31,36.95 32.31,46.72 33.82,52.32
  Bottom 0.61: 31.86,27.29 30.72,25.26 28.88,22.09 27.99,21.2 25.83,21.2 24.18,23.74 22.66,23.74 21.64,21.7 20.62,21.07 18.84,21.07 17.7,22.21 v17.58,24.12 | 2.11 9.41,29.23 11.61,27.04
GND  (via drill 0.6)  (1 unrouted)
  Top 0.406: IC102.2@1 IC102.2
  Top 1.27: 22.97,58.53 22.97,53.14
  Bottom 0.61: X102.1 43.61,3.92 R104.2
  Bottom 1.27: v24.05,44.18 23.67,44.56 23.67,52.95 23.54,53.07 23.54,53.33 23.16,53.84 23.16,54.98
  other vias: 19.23,59.68 37.39,23.48 14.8,13.08 39.8,37.83 24.31,40.5 34.94,7.58 16.05,1.63 44.88,76.06 25.32,34.28 42.34,46.98 48.82,28.05 22.27,15.36 28.3,65.01 1.06,75.43 25.32,26.15 18.84,29.32 8.69,52.82 37.07,80.51 21.51,23.99 16.18,49.9 20.5,75.43 13.87,72.48 8.05,75.43 25.2,94.48 44.5,52.19 26.34,71.69 44.88,64.89 29.26,25.9 15.67,60.19 6.15,29.96 0.87,39.6 0.62,52.6 7.47,18.96 0.97,8.56 16.4,10.28 25.47,17.75 28.97,14.15 32.27,18.75 35.39,41.58 42.1,41.63 36,87.91 43.37,84.71 16.81,91.17 6.15,81.27 1.06,70.85 0.56,59.42 15.54,53.33 11.23,90.67 14.15,75.17 20.5,72.89 45.13,70.98 34.69,1.74 29,92.95 14.02,91.43 46.28,31.61 45.01,34.41 44.75,39.99
  pour Top (rank 3): -0.08,95.3 -0.08,0.7 43.1,0.7 44.12,0.5 44.12,9.89 44.5,13.07 50.09,13.07 50.09,95.3
  pour Bottom: -0.08,0.7 50.09,0.7 50.09,95.3 -0.08,96.01
N$1  (via drill 0.6)  (1 unrouted)
  Top 0.61: 38.53,89.65 37.13,88.76 v37.13,83.3 37.13,83.68
  Top 0.813: 38.53,89.65 D107.1 39.42,90.16 42.72,90.16 42.85,90.03 42.85,86.68 | D108.1 40.62,84.15 42.85,86.68 | 42.85,86.68 42.95,86.44 43.38,86.36 JP102.1
  Top 1.016: 17.26,31.23 17.08,30.1 17.08,30.07 2.9
  Bottom 0.61: 22.4,39.36 23.54,41.77 26.72,42.79 26.72,49.65 24.99,52.31 24.99,58.53 25.96,59.42 26.97,59.8 29.64,60.69 29.64,66.28 29.13,67.04 29.13,70.98 29.51,72 29.51,75.43 28.88,76.19 28.88,81.27 31.16,83.55 36.88,83.55 v37.13,83.3 | 20.11,39.36 19.35,38.47 17.7,36.82 JP103.2
  Bottom 0.813: 22.4,39.36 20.11,39.36 | 2.9 15.86,30.54 15.86,36.76 17.38,36.76 JP103.2
N$2  (via drill 0.6)  (1 unrouted)
  Top 0.406: IC105.10 13.26,10.28 12.62,10.78 12,11.04 11.3,11.74 11.3,12.8 10.9,13.6 R3.1 | R3.2 10.99,15.68 v11.59,16.94
  Top 0.61: R111.1 16.3,79.57 X101.4
  Bottom 0.305: 12.24,75.71 8.08,63.28 8.08,60.02 5.51,58.79
  Bottom 0.356: 5.51,58.79 5.51,52.19
  Bottom 0.406: 5.51,52.19 5.13,50.41 5.13,29.45 6.53,27.42 6.65,27.29 8.24,24.37
  Bottom 0.61: X101.4 15.03,78.15 12.24,75.71 | 8.24,24.37 11.03,19.74 11.63,17.51 v11.59,16.94 10.65,14.97 10.65,11.42 9.76,9.77 6.53,9.77 3.29,11.23 3.29,14.4 2.65,15.04 X103.2
N$3  (via drill 0.6)  (1 unrouted)
  Top 0.406: IC105.13 9.45,10.21 8.25,11.41 R2.1 | R2.2 7.67,13.32 v7.67,14.3
  Top 0.61: R110.1 11.1,79.59 X101.3
  Bottom 0.356: 4.82,59.49 4.82,53.26
  Bottom 0.406: 10.91,74.47 7.29,63.74 7.29,60.76 4.82,59.49 | 4.82,53.26 3.6,47.3 3.6,21.39 4.62,20.24 6.91,17.51 6.91,16.37 7.66,14.88 | 7.67,14 7.67,14.21 | 7.67,14.21 v7.67,14.3 | v7.67,14.3 7.66,14.88 | 3.6,17.26 5.19,15.67 7.25,15.67 7.66,14.88 | v7.67,14.3 7.67,14.21
  Bottom 0.61: X101.3 10.91,77.98 10.91,74.47 | X103.3 3.29,17.58 3.6,17.26
N$4  (1 unrouted)
  Top 0.406: 2.7 22.02,31.23 22.02,34.53 23.25,35.51
  Top 0.61: TP22.TP 23.29,29.2 2.7 | 23.25,35.51 LED101.A
  Bottom 0.406: 29,58.73 29,54.09
  Bottom 0.61: X101.8 30.94,75.4 33.45,73.14 38.31,68.28 38.31,62.44 29,58.73 | 29,54.09 29,40.12 23.54,35.8 23.42,35.67 23.35,35.48
N$5
  Top 0.305: 45.77,24.12 45.77,16.78
  Top 0.406: Q101.3 45.77,24.12 | 45.77,16.78 44.63,16.24 42.09,16.24 41.83,15.99
  Top 0.61: 41.83,15.99 R102.2
N$6
  Top 0.406: Q2.1 10.45,92.07 9.07,90.68 7.75,90.68 R8.1
N$7
  Top 0.406: IC101.2 44.5,67.17 45.52,68.19 R107.2
N$8
  Top 1.27: R127.2 R129.1
N$9  (via drill 0.6)
  Top 0.406: v45.13,14.21 45.64,13.2 Q102.3 | 36.12,11.29 v36.37,11.42 | 37.01,12.43 R106.2
  Top 0.61: v36.37,11.42 37.01,12.43
  Bottom 0.406: v36.37,11.42 36.24,11.42 38.02,14.97 39.8,16.5 42.34,16.5 44.37,14.21 v45.13,14.21
N$10
  Top 1.016: 23.29,87.38 21.13,87.38
N$11  (via drill 0.6)
  Top 0.406: Q104.2 30.72,85.71
  Top 0.61: START.TP v28.56,85.52 | Q104.2 31.04,93.15 31.23,93.98 31.12,93.34 D105.2
  Top 0.813: v28.56,85.52 30.72,85.71
  Bottom 0.813: X101.5 19.06,79.2 21.64,81.9 25.2,81.9 26.97,83.55 28.43,85.08 v28.56,85.52
N$12  (1 unrouted)
  Top 0.61: TP16.TP 2.2 | 47.04,77.97 47.04,86.49 47.42,86.87 47.42,88.9 45.64,91.69 45.64,93.22 44.12,94.54 40.05,94.54 39.55,94.23 D109.2
  Bottom 0.711: 44.8,58.66 44.8,54.47
  Bottom 0.813: X101.12 46.78,78.21 46.78,74.66 47.17,73.78 47.17,60.06 44.8,58.66 | 44.8,54.47 44.8,54.09 46.02,53.2 46.02,38.98 42.34,33.52 42.34,33.64 LED102.K 2.2
N$13  (1 unrouted)
  Top 0.61: TP17.TP 2.3 | X101.11 43.58,80.22 44.37,81.9 D108.2
  Bottom 0.406: 36.07,33.05 35.89,33.52 35.89,37.07 34.21,38.34
  Bottom 0.61: 37.26,33.05 36.07,33.05 | 34.21,38.34 34.21,45.52 38.28,51.68 38.28,52.82 38.78,53.2 39.55,53.2 40.83,54.1 40.83,54.27
  Bottom 0.711: 40.83,54.27 40.83,59.03
  Bottom 0.813: 2.3 37.26,33.05 | 40.83,59.03 40.83,59.44 41.45,59.93 41.45,72 42.85,73.39 42.85,74.56 X101.11
N$14  (1 unrouted)
  Top 0.61: TP18.TP 33.77,23.72 2.4 | X101.10 38.86,77.72 38.85,77.71 38.85,79.44 38.78,79.83 D107.2
  Bottom 0.406: 33.2,37.96 35.08,36.56 35.08,33.39 33.77,33.07
  Bottom 0.61: 36.89,52.19 33.2,46.47 33.2,37.96
  Bottom 0.711: 36.89,58.73 36.89,52.19
  Bottom 0.813: X101.10 38.85,78.2 38.85,76.84 40.31,74.49 40.31,60.63 36.89,58.73 | 33.77,33.07 33.75,25.82 2.4
N$15
  Top 0.406: Q105.2 7.29,43.3 7.54,43.3
  Top 0.813: IC109.3 7.54,43.3
N$16
  Top 0.406: 42.34,45.48 43.61,45.48 IC108.8 | 42.34,45.48 IC108.6 | 42.34,45.48 42.3,45.48 40.8,46.98 35.23,46.98 33.83,47.99 33.83,48.25 33.58,48.5 32.05,49.77 29.89,49.77 29.51,49.39 29.51,48.63 28.75,47.49 24.81,47.49 23.8,48.5 R120.1
N$17  (1 unrouted)
  Top 0.406: IC105.12 10.72,10.21 9,11.86 9,14.55 7.52,16.21 7.41,16.21 R1.1 | R1.2 2.57,20.12 X103.4
  Top 0.61: R109.1 10.21,81.41 7.92,79.12 7.41,78.6 X101.2
  Bottom 0.406: 6.53,64.5 6.53,61.47 2.97,59.69 1.47,58.53 1.47,54.41 2.78,46.6 2.78,20.43
  Bottom 0.61: X101.2 7.1,78.13 9.64,75.55 9.57,74.03 8.81,71.11 7.54,67.93 6.53,64.5 | X103.4 1.06,20.43 2.78,20.43
N$18
  Top 0.406: IC105.15 6.91,7.1 7.92,6.21 15.42,6.21 16.41,5.85 27.73,5.85 29.26,4.71 IC107.5
N$19
  Top 0.406: 19.31,26.61 20.11,26.7 20.11,32.82 19.94,32.82 LED106.K | 16.16,33.01 15.27,34.2 D110.2
  Top 0.61: LED106.K 16.16,33.01
  Top 1.016: 2.8 TP23.TP 19.31,26.61
  Bottom 0.61: 6.27,33.13 10.97,30.91 10.97,29.64 11.73,28.88 12.24,28.5 15.1,25.71 18.46,25.71 | 19.48,24.73 2.8
  Bottom 0.813: X101.14 7.18,52.42 6.27,50.28 6.27,33.13 | 18.46,25.71 19.48,24.73
N$20  (via drill 0.81)  (1 unrouted)
  Top 0.813: 14.27,31.61 13.13,32.5 13.13,36.06 v12.49,36.95 11.12,38.72
  Top 1.016: 1.9 16.25,20.81 TP9.TP 15.81,25.06 14.4,26.79 14.4,30.72 14.27,31.61
  Bottom 0.813: X101.17 19.06,53.37 19.35,52.69 20.24,51.04 20.75,50.03 20.75,42.66 19.1,41.14 14.65,41.14 v12.49,36.95
N$21  (via drill 0.6)
  Top 0.61: 7.54,30.66 5.13,32.31 5.13,36.86 6.27,37.85 6.78,38.72 | 6.78,38.72 8.56,38.72 9.95,40.82 18.84,40.82 19.92,39.67 v20.43,37.39 | D103.1 6.78,38.72
  Top 1.016: 7.54,30.66 7.54,27.67 9,26.09 TP11.TP 9.32,21.07 9.32,19.2 1.11
  Bottom 0.61: X101.19 26.98,53.02 27.86,50.53 27.86,41.07 23.54,37.39 v20.43,37.39
N$22  (1 unrouted)
  Top 0.406: IC111.11 6.75,63.11 6.24,62.75 6.25,60.5 5.8,60.38 | 5.8,60.38 6.4,60.57 IC111.9 | 5.8,60.38 5.19,59.17 5.2,58.74 5.2,54.09 | R146.2 2.46,29.26 3.7,30.5 3.7,36.93 4.23,38.68 4.23,51.25 5.2,54.1
N$23  (via drill 0.6)
  Top 0.406: X101.22 38.86,54.34 41.27,52.13 42.67,52.13 44.8,54.09 44.8,59.42 46.34,60.64 | 46.34,60.64 R105.2 | v43.36,59.8 44.76,59.42 46.34,60.64
  Bottom 0.406: D104.C 43.99,62.34 43.86,62.34 43.36,61.84 v43.36,59.8
N$24  (1 unrouted)
  Top 0.406: 48.44,69.71 48.44,64.76 47.42,64 R105.1 | IC101.3 44.24,68.44 45.64,69.84 46.91,69.84 | 46.91,69.84 48.44,69.84 | C101.1 46.91,69.84
N$25
  Top 0.406: IC107.13 27.99,10.91
  Top 0.61: TP6.TP 26.78,12.97 1.6 26.72,12.43 27.1,11.8 27.99,10.91
N$26
  Top 0.406: 1.7 24.77,15.73 24.81,11.93 26.72,10.53 IC107.14
  Top 0.61: TP7.TP 23.16,18.53 1.7
N$27
  Top 0.61: D1.2 23.48,82.36 22.02,83.82 22.02,84.96 R12.1 R13.1
N$28  (via drill 0.6)
  Top 0.406: v27.48,35.55 27.86,34.66 27.86,25.9 26.75,24.78 2.6 | v30.66,52.57 28.88,54.34 28.88,58.41 27.72,59.17 25.07,59.17 25.07,62.73 25.11,63.23 25.11,65.84 25.45,66.35 29.64,66.35 | JP105.2 31.16,67.42
  Top 0.61: TP21.TP 26.78,23.7 2.6 | 31.16,67.42 29.64,66.35
  Bottom 0.406: v30.66,52.57 30.66,51.04 30.4,50.79 30.4,39.36 v27.48,35.55
N$29
  Top 0.61: JP101.1 R119.2
N$30
  Top 0.406: R122.2 C105.1 46.78,50.28 | IC108.9 42.47,50.41 43.1,50.91 45.26,50.91 45.9,50.28 46.78,50.28 | 46.78,50.28 R123.2
N$31
  Top 0.406: IC108.14 35.92,49.65 34.72,49.65 32.69,51.17 28.62,51.17 27.86,50.53 | R126.2 27.86,50.53 | 27.86,50.53 C106.2
N$32
  Top 0.406: R8.2 6.03,89.9 6.78,88.9 9.26,88.9 Q3.3
N$34
  Top 0.61: LED101.K 24.65,31.38 R143.1
N$35
  Top 0.406: R120.2 17.79,48.5 IC109.1
  Top 0.61: R134.1 15.14,48.4 IC109.1
  Bottom 0.711: 17.09,53.84 17.09,59.36
  Bottom 0.762: 22.86,63.36 22.86,69.84
  Bottom 0.813: 17.09,53.84 18.21,51.42 IC109.1 | 19.12,62.62 22.86,63.36
  Bottom 1.016: 17.09,59.36 19.12,62.62 | X101.7 27.08,78.12 27.08,75.52 25.83,74.66 25.07,72.89 22.86,69.84
N$36
  Top 0.406: R126.1 24.31,51.04 12.37,51.04 9.8,49.75 9.8,47.18 9.6,46.98 Q105.1
N$37  (via drill 0.6)
  Top 0.406: IC105.2 6.91,4.24 v3.73,5.83 | IC107.7 31.8,5.21 v31.55,5.47
  Bottom 0.406: 4.37,5.83 6.02,4.56 16.94,4.56 17.49,5.01 19.65,5.01 20.11,1.66 31.55,1.66 v31.55,5.47
  Bottom 0.61: v3.73,5.83 4.37,5.83
N$38
  Top 0.406: 1.3 36.74,17.89 33.58,17.89 32.05,16.37 32.05,13.83 30.53,10.55 IC107.11
  Top 0.61: TP3.TP 37.48,18.21 1.3
N$39
  Top 0.406: 1.5 30.25,15.85 30.15,15.74 30.15,13.45 29.89,12.94 29.89,12.05 29.26,10.55 IC107.12
  Top 0.61: 1.5 28.6,18.44 TP5.TP
N$41
  Top 0.61: LED102.A 41.07,35.55 41.58,36.06 41.58,37.64 R142.1 | LED103.A LED104.A LED105.A
  Bottom 0.508: 24.43,31.61 22.4,31.61
  Bottom 0.61: LED102.A LED103.A | 24.43,31.61 24.81,31.61 28.5,33.77 LED105.A | 22.4,31.61 21.26,32.5 21.26,34.04 LED106.A
N$42
  Top 0.406: X101.16 15.1,58.47 15.16,58.53 19.35,61.08 19.99,61.08 R140.2
N$43
  Top 0.406: R128.2 32.69,85.59 32.68,89.14 Q104.1
N$44  (via drill 0.6, 0.8 pad 1.68)
  Top 0.406: IC107.2 IC107.1 23.52,2.8 21.25,2.8 | 21.25,2.8 18.24,2.8 15.29,5.32 9.07,5.32 8.18,4.43 IC105.3 | Q106.1 17.93,8.29 v16.77,8.29 | v21.25,3.59 21.25,2.8 | Q1.1 34.14,5.65 v33.45,6.35
  Bottom 0.406: v16.77,8.29 21.25,5.7 | 21.25,5.7 v21.25,3.59 | v33.45,6.35 32.94,6.86 22.41,6.86 21.25,5.7
N$45
  Top 0.406: C107.1 29.92,43.62 R125.1 R130.2
N$46  (via drill 0.6)
  Top 0.406: 39.8,45.71 39.04,46.22 34.72,46.22 32.69,47.74 31.93,48.37 R130.1 30.25,48.12 C108.1 | 39.8,45.71 IC108.4 | IC108.10 41.1,49.3 41.1,50.5 41.6,51 v41.6,51.1 | v40.4,45.7 v40.39,45.71 39.8,45.71
  Bottom 0.406: v41.6,51.1 40.4,49.9 v40.4,45.7
N$47  (via drill 0.6)
  Top 0.406: R133.2 R132.2 37.13,38.6 37.64,39.1 39.29,39.1 R131.1 41.07,41.01 41.07,41.6 | IC108.5 41.07,41.6 | IC108.11 v39.8,51.2 | v40.4,41.7 40.6,41.6 41.07,41.6
  Bottom 0.406: v39.8,51.2 38.9,49.3 38.9,42.9 40.3,41.7 v40.4,41.7
N$48
  Top 0.406: R138.2 28.75,74.47 31.16,74.47 Q107.3
N$49  (via drill 0.6)
  Top 0.406: IC111.7 4.1,61.84 v4.49,62.23 | Q3.1 8.38,86.69 v8.3,86.61
  Bottom 0.406: v4.49,62.23 4.49,64.77 5,65.28 5,75.44 5.26,75.69 5.26,80.26 4.75,80.77 4.75,83.31 8.05,86.61 v8.3,86.61
N$50  (via drill 0.6)
  Top 0.406: IC107.4 27.99,4.52 27.35,4.96 20.94,4.96 v18.59,4.07
  Top 0.61: v4.23,3.29 5.64,3.29 IC105.1
  Bottom 0.406: v18.59,4.07 18.59,3.74 18.54,3.68
  Bottom 0.61: 18.54,3.68 18.4,3.67 4.64,3.67 v4.23,3.29
N$51
  Top 0.61: R115.1 34.97,54.28 X101.21
N$52
  Top 0.406: 24.18,9.28 IC107.16 24.18,10.02 23.3,10.9 21,10.9 20.4,10.3 19.5,10.3 Q106.3 | Q106.3 19.02,10.28 17.9,11.2 16.9,12 16.9,12.3 R9.1 | 19.55,10.2 Q106.3
N$53  (via drill 0.6)
  Top 0.61: TP25.TP 12.81,23.8
  Top 0.813: v12.81,30.59 12.81,23.8 2.10
  Bottom 0.813: X101.15 8.24,36.56 8.24,34.28 12.11,32.5 12.81,31.1 v12.81,30.59
N$54
  Top 0.813: D106.1 37.08,91.28 37.52,91.69
  Top 1.27: 37.52,91.69 41.45,91.69 R127.1
N$55
  Top 0.61: TP19.TP 31.14,31.86 30.25,30.98 2.5 | X101.9 35.23,80.2 35.23,85.02 D106.2
  Bottom 0.406: LED105.K 31.57,34.22 31.57,36.44 31.29,36.82 | 32.97,53.93 32.97,57.17 32.94,58.92
  Bottom 0.61: 2.5 LED105.K | 31.29,36.82 31.29,47.08 32.05,50.28 32.05,52.06 32.97,53.74 32.97,53.93 | X101.9 34.97,78.08 34.97,73.9 39.29,69.33 39.29,61.71 32.94,58.92
N$56  (1 unrouted)
  Top 0.406: IC105.14 8.18,7.74 8.81,7.1 15.67,7.1 16.69,6.74 28.24,6.74 30.53,4.83 30.53,3.06
N$57  (via drill 0.6)  (2 unrouted)
  Top 0.406: Q101.1 48.94,24.12 48.94,13.91 Q102.1 | 41.07,8.62 X102.2
  Top 0.61: 41.07,5.83 X102.2 39.2,8.84 R103.1 | 41.07,5.83 v41.01,5.51 | 41.07,5.83 41.07,3.99 R101.1 | 42.59,9.89 41.07,8.62 | Q102.1 47.42,12.33 Q102.2 | 47.17,9.89 47.17,6.72 | 48.94,9.13 46.91,9.13 | 47.42,8.37 45.39,8.37
  Top 0.813: 47.17,9.89 42.59,9.89
  Bottom 0.61: X102.2 v41.01,5.51 40.75,3.92 | 40.63,3.54 R104.1
  pour Top: 44.88,13.2 44.88,2.02 49.96,2.02 49.96,13.2
N$58
  Top 0.406: 1.8 19.8,12.89 | 19.92,15.67 TP8.TP 19.78,15.69 | R9.2 16.9,15.1 19.8,15.1
  Top 0.61: TP8.TP 19.8,15.1 19.8,12.99 | 19.8,12.81 19.8,12.99 | 19.8,12.99 1.8
N$59
  Top 0.406: Q101.2 47.42,16.5 43.86,14.97 43.86,12.43 TP2.TP
  Top 0.61: TP2.TP 41.58,12.3 40.95,12.3 1.2 | 48.05,21.07 48.05,19.67 | 46.53,21.07 46.53,19.67
  pour Top: 46.15,23.86 46.15,17.01 44.88,15.74 39.55,15.48 39.55,10.66 40.56,10.4 42.59,10.66 44.63,13.2 44.88,13.2 45.39,13.83 49.2,13.83 49.2,23.86
N$60  (via drill 0.6)
  Top 0.406: Q107.1 32.81,70.6 32.81,68.76 | 32.81,68.76 32.81,68.31 32.94,68.06 32.94,66.92 32.69,66.54 31.55,65.9 | v37.01,64.5 39.29,62.98 39.29,60.06 37.26,58.28 37.26,54.34 38.46,53.48 38.46,51.46 38,51.1 37.7,51.1 37.2,50.6 37.2,49.33 IC108.13 | R135.2 29.64,68.5 30.02,68.76 32.81,68.76
  Top 0.813: 31.55,65.9 JP105.1
  Bottom 0.406: v37.01,64.5 33.96,64.76 JP105.1
N$61  (1 unrouted)
  Top 0.305: 26.72,3.18 26.72,1.53 23.29,1.53 22.78,1.91
  Top 0.406: 22.78,1.91 17.66,1.91 14.97,4.48 11.99,4.48 IC105.6
N$64
  Top 0.61: IC109.2 R134.2
N$65
  Top 0.406: R144.2 14.02,60.57 14.91,61.33 15.98,62.22 IC110.5
N$67
  Top 0.406: IC107.10 31.8,10.55 32.31,11.18 32.86,12.05 1.4
  Top 0.61: TP4.TP 33.77,12.96 1.4
N$69  (via drill 0.6)
  Top 0.61: TP1.TP 1.1
  Top 0.813: D2.2 8.04,82.53 v7.99,81.52
  Bottom 0.61: 48.37,36.25 48.37,30.09
  Bottom 0.813: v7.99,81.52 8.29,82.41 14.8,82.45
  Bottom 1.016: 14.8,82.45 20.81,90.41 38.4,90.41 38.4,85.2 40.18,82.92 47.99,82.92 49.58,82.03 49.58,52.38 48.82,49.26 48.82,39.87 48.37,36.25 | 48.37,30.09 46.72,28.25 46.72,22.57 1.1
N$83
  Top 0.406: 46.66,44.95 45.26,44.95 IC108.7 | 46.47,46.03 R122.1 46.66,46.22 46.66,44.95 | 46.66,44.95 46.66,43.93 R121.1
N$84
  Top 0.406: Q106.2 20.37,8.77 21.1,9.5 21.91,9.5 R4.2
N$85  (1 unrouted)
  Top 0.406: Q103.1 34.44,63.24 34.72,65.15 R116.2
N$86
  Top 0.406: R144.1 10.59,60.95 10.59,63.49 | 10.59,63.49 IC110.3 | 10.59,63.49 9.7,64.38 IC111.12 4.63,64.38 3.48,65.53 2.17,65.53 IC111.4
N$87
  Top 0.406: R140.1 22.34,63.11 22.34,68.44 22.66,69.33 D112.1
N$88  (via drill 0.6)
  Top 0.406: IC107.15 25.58,9.43 25.38,10.31 24.11,11.37 v23.04,11.93 | R128.1 v32.69,81.27
  Bottom 0.406: v23.04,11.93 24.81,14.47 24.81,15.48 25.58,16.24 28.37,16.24 29.13,15.48 30.66,15.48 34.47,19.29 34.97,19.29 36.5,20.82 37.89,20.82 39.67,19.04 41.58,19.04 45.64,23.1 45.64,29.2 47.55,31.23 47.55,35.43 47.04,36.07 47.04,51.82 48.31,53.47 48.31,53.45 48.56,53.84 48.56,81.01 47.42,81.78 33.7,81.78 v32.69,81.27
N$89
  Top 0.406: IC111.14 9.7,66.92 11.35,69.58 12.75,69.58 R145.1 | 14.15,70.47 R145.1 | C110.1 16.18,68.69 14.78,70.47 R145.1
N$90
  Top 0.406: TP13.TP 5.76,23.73 2.12 5.49,23.99 4.37,23.99 2.46,25.9 R146.1
N$91
  Top 0.813: X101.1 3.22,80.38 3.26,81.1 3.26,83.06 D2.1
N$92
  Top 0.406: IC101.1 41.45,65.9 40.82,66.54 R108.2
N$93  (via drill 0.6)
  Top 0.813: D103.2 8.94,35.25 D102.2 11.1,34.28 v9.57,35.42
  Top 1.016: 1.10 TP10.TP 13.38,18.02 11.87,19.54 10.91,22.4 10.91,26.15 11.23,26.47 11.23,32.25 8.94,32.75
  Top 1.93: 8.94,32.75 8.94,35.25
  Bottom 0.61: 17.19,63.73 17.46,63.73 | SJ101.1 17.19,65.01 17.97,64.24
  Bottom 0.711: 13.13,54.22 13.13,59.55
  Bottom 0.813: v9.57,35.42 9.57,36.82 13.13,54.22 | 13.13,59.55 17.09,63.36 17.46,63.73 17.97,64.24 18.74,65.01 JP104.1
N$94
  Bottom 0.61: 17.58,69.49 17.19,68.6 SJ101.2
  Bottom 0.813: 22.4,87.36 R136.2 | 22.4,87.36 R137.2 | JP104.2 19.48,67.55 17.58,69.49 17.07,69.97 17.07,81.39 22.4,86.6 22.4,87.36
N$95  (via drill 0.6)
  Top 0.813: D109.1 34.72,93.73 v35.48,94.23
  Bottom 0.813: v35.48,94.23 35.74,94.23 37.26,94.49 39.8,94.49 40.05,94.74 43.36,94.74 46.66,91.44 46.66,89.02 JP102.2
N$96
  Top 0.406: C103.1 R108.1 R112.1
N$97  (1 unrouted)
  Top 0.406: IC101.5 37.71,69.9 36.88,70.73 | 36.88,70.73 36.24,71.36 | R112.2 38.02,71.87 36.88,70.73 | Q1.3 37.51,4.72 37.51,3.81 38.98,2.35 38.98,1.33 39.55,0.76 43.1,0.76 43.61,1.27 43.61,2.54 44.88,3.81 46.15,3.81 49.96,7.62 49.96,29.72 48.18,31.5 48.18,34.29 49.96,35.81 49.96,74.68 49.71,74.93 36.24,74.93 36.24,73.66 | 36.24,73.66 36.24,71.42 | R117.2 36.24,73.66
N$98
  Top 0.406: 15.18,38.22 15.18,38.68 D110.1
  Top 0.61: JP103.1 15.59,39.36 D110.1
N$99
  Top 0.406: 30.27,71.23 29.39,71.62 R138.1
  Top 0.813: 30.27,71.23 JP105.3
N$100
  Top 0.406: Q103.3 32.78,60.1 31.9,60.1 31.27,60.73 R5.1
N$101
  Top 0.406: R113.1 41.96,61.58 43.36,63.23 43.48,63.23 R114.2 43.36,63.36 42.09,64.76 40.56,64.76 39.8,65.52 39.8,67.81 39.29,68.31 37.84,68.31 IC101.6
N$102
  Top 0.305: 18.72,67.04 19.23,66.54 19.23,63.81 18.84,63.49
  Top 0.406: IC110.2 13.77,64.76 16.05,67.04 18.72,67.04 18.72,67.93 19.16,68.69 19.16,70.43 21.34,72.02 21.89,72.78 D112.2 22.06,74.03 C109.2 R141.1 14.91,74.16 13.63,74.18 12.81,75 D4.C | 18.84,63.49 IC110.6
N$103
  Top 0.406: IC111.2 2.06,68.33 3.48,68.33 3.99,68.83 3.99,69.85 2.97,70.87 2.97,71.5 C15.2 2.84,72.52 3.48,73.15 4.11,74.17 R10.1
N$104
  Top 0.406: SJ2.2 11.86,93.22 11.61,93.47 10.44,93.47 Q2.2
  Top 0.813: Q2.2 5.89,93.53 5.38,93.4 R129.2
N$107
  Top 0.406: IC101.7 37.57,67.31 36.5,67.31 | 36.5,67.31 35.99,67.82 35.99,69.09 R116.1 R117.1 | R115.2 37.39,52.96 36.5,53.85 36.5,58.67 38.53,60.45 38.53,62.48 37.39,63.25 36.37,63.25 35.99,63.5 35.99,66.8 36.5,67.31
N$108
  Top 0.406: 32.18,38.22 R133.1 32.24,38.94 32.6,39.3 34.6,39.3 37.3,42 37.3,43.63 IC108.2
N$580  (1 unrouted)
  Top 0.406: IC108.1 34.85,43.68 33.77,43.3 R124.2 32.43,43.3 32.05,42.53 31.93,42.28 R125.2
V+  (via drill 0.6)  (2 unrouted)
  Top 0.305: 19.87,95.17 19.75,95.2
  Top 0.406: 6.02,51.3 6.02,51.05 5.76,50.8 5.76,46.39 Q105.3 | 19.75,95.2 13.52,95.2 13.56,95.21 12.89,95.12 12.88,95.11 12.88,95 | 12.81,95.06 12.88,95 | 12.88,95 SJ2.1 12.55,95.06 Q2.3
  Top 0.61: Q104.3 29.54,90.7 28.69,89.53 | 28.69,89.53 v28.69,89.22 | 19.87,95.17 20.11,92.39 21.7,90.81 23.61,90.81 24.88,89.53 28.69,89.53 | D1.1 23.02,79.11 | 21.1,58.6 24.01,61.51 arc45 24.3,62.21 24.3,76.2 23.31,77.19 arc-45 23.02,77.89 23.02,78.9
  Top 0.813: 6.02,51.3 10.56,51.27 11.84,52.06 20.1,52.06 21.01,54.21 arc45 21.1,54.42 21.1,58.6
  Bottom 0.61: v28.69,89.22 29.96,85.09 23.98,79.11 23.02,79.11 X101.6
VCC  (via drill 0.6)
  Top 0.406: R124.1 33.77,45.26 34.85,45.43 38.53,45.43 IC108.3 38.53,41.64 38.02,41.14 38.02,41.07 R131.2 | R121.2 47.67,42.41 45.01,42.41 43.87,41.27 43.74,41.27 | IC102.1 44.27,36.47 43.86,35.93 | R113.2 40.05,63.36 | 40.05,63.36 37.77,65.01 37.77,65.84 IC101.8 | 40.05,63.36 40.05,60.57 40.82,59.17 40.82,53.84 v42.09,53.07 | 6V.TP 42.72,32.63 43.8,33.71
  Top 0.61: v36.88,40.12 R131.2 | 43.1,35.93 43.1,37.83 | 43.1,37.83 43.1,39.36 | C104.1 43.8,33.71 43.86,33.77 43.86,35.93 | R142.2 43.1,37.83
  Top 0.813: 43.86,35.93 43.1,35.93 | 43.1,39.36 43.1,40.63 | 43.1,40.63 v42.98,40.5 | 43.74,41.27 43.1,40.63
  Bottom 0.406: v42.09,53.07 43.29,52.22 43.36,49.26 43.74,48.88 43.74,41.75 42.98,40.99 v42.98,40.5
  Bottom 0.61: v42.98,40.5 37.39,40.5 v36.88,40.12

### Text on the board
Top: BEP V3.3 / maru-labs.com | top
Bottom: BEP V3.3 / maru-labs.com
tPlace: QC | 3 | 1 | b | c | a | 4 | 2 | 5 | 5 | 4 | 3 | 1 | 2
bPlace: QC
tNames: 78L10 | BSS138 | < / / > / / G5 / / G3 / / G1 / / / BAT | GND / / <> / / N / / G4 / / G2 / / CC | BSS138 | N | N
bNames: 1 BAT / 2 GC / 3 GB / 4 GA / / / 7 RES / 8 ABS / 9 ALT / 10 TMP / OIL | enable / Choke / on WRN | OFF/ ON | CHK | BL <> / Resistor | GND / BT / HiB | 18 | 19 | 13 / 14 / 15 / 16 / 17 / / / / 21 SPDin / 22 SPDout / 23 / 24 | RPM | enable / Bulb Test / on WRN / ON / OFF | ALT / TMP / OIL / CHK / SWP | WRN | 2.7 / 2.6 | 2.12 / 2.11 / 2.10 / / / / / 2.5 / 2.4 / 2.3 / 2.2 / 2.1 | RPM / SPD / HiB | GND c b a 12V | 1.12 GND / 1.11< / 1.10<> / 1.9 > / 1 8 N / 1.7 G5 / 1.6 4 / 1.5 G3 / 1.4 G2 / 1.3 G1 | 1.2 CC | 1.1 BAT
tValues: M7 | SS12 | M7 | SS12 | SS12 | 1 BAT / 2 GC / 3 GB / 4 GA / STRT / 6SWP / 7RES / 8 ABS / 9ALT / 10 TMP / 11OIL / 12CHK | M7 | 13 GND / 14 BT / 15 HiB / 16RPM / 17 > / 18 GND / 19 < / / 21SPD in / 22SPD out / 23 GND | 6,8 | 4 | 4.7V | M7 | M7 | M7 | 6V | SS12 | SPD / / WRN / / ABS / / ALT / / OIL / / SWP | 2.4/1.1V | RPM / / HiB / / BT / / BAR / / TMP / / CHK | BA | BA
bValues: 2.2 kOhm / SPD / Pull-up / (Middle / Switch ) | OFF ON | OFF/ ON | BAR/RES | Mode / Selector | > | > | BAR/RES | ABS | BT
tStop: BEP V3.3 test / maru-labs.com
bStop: BEP V3.3 test / maru-labs.com